# EAGLE design usb2cmi (EAGLE 4.11)

## Sheet 1 of 6
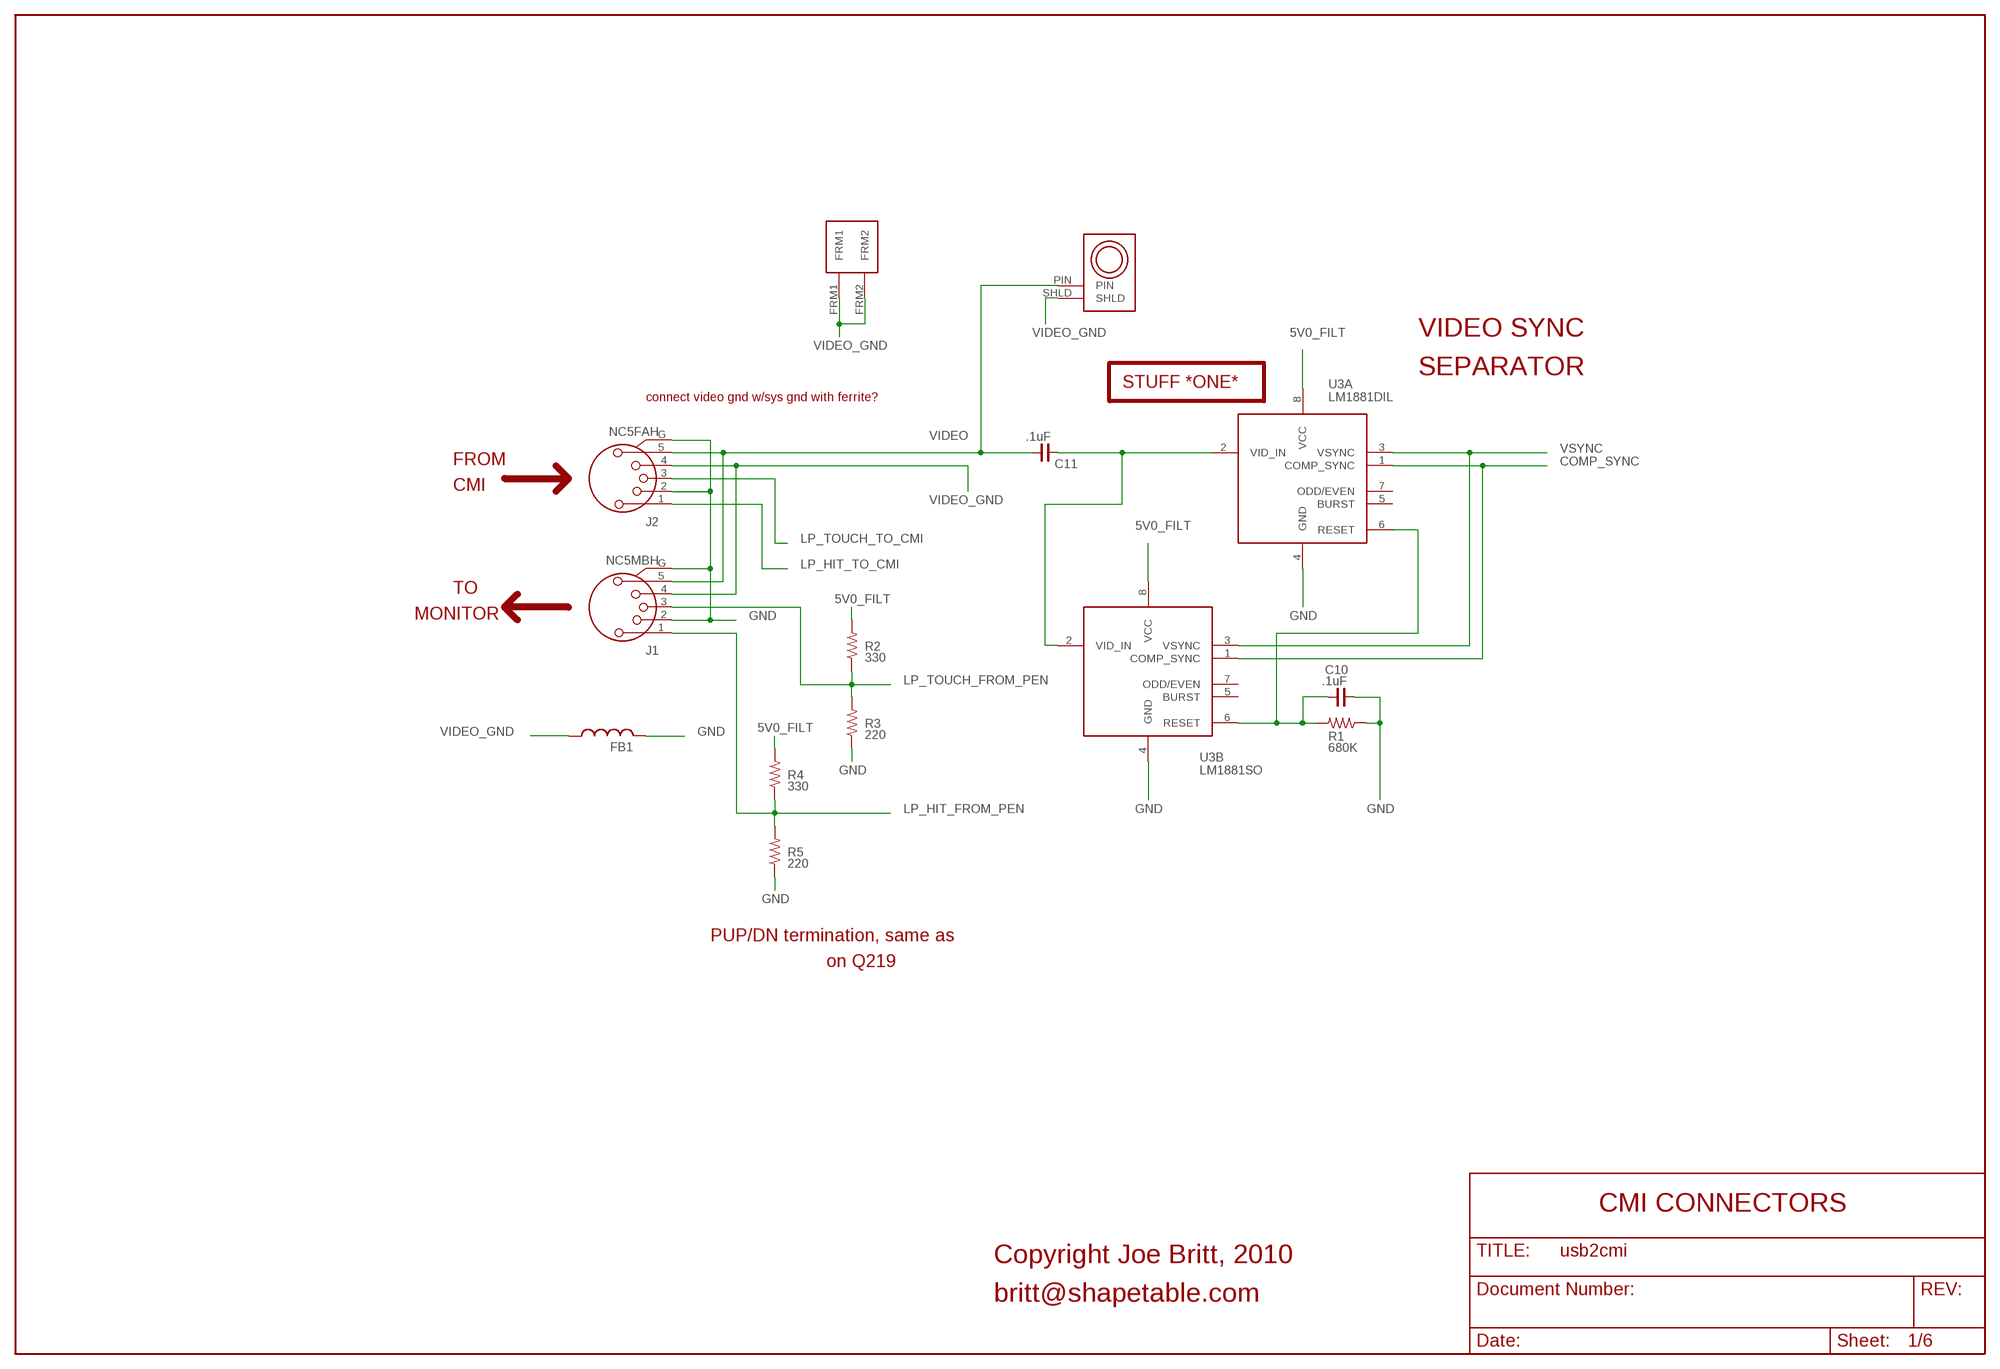
[diagram p0: schematic, sheet 1]

### Parts
C10  .1uF  C_0603  [C0603]
C11  .1uF  C_0603  [C0603]
FB1  L-US0207/15  [0207/15]
J1  NC5MBH  [NC5MBH]
J2  NC5FAH  [NC5FAH]
J3  RCA-HSC  [RCA-SHIELDED]
R1  680K  R_0603  [R0603]
R2  330  R_0603  [R0603]
R3  220  R_0603  [R0603]
R4  330  R_0603  [R0603]
R5  220  R_0603  [R0603]
U3A  LM1881DIL  [DIL08]
U3B  LM1881SO  [SO08]

### Nets
5V0_FILT: R2.2 R4.2 U3A.8(VCC) U3B.8(VCC) ; also sheet 2,3,5,6
COMP_SYNC: U3A.1(COMP_SYNC) U3B.1(COMP_SYNC) ; also sheet 2
GND: C10.2 FB1.2 J1.2 J1.G J2.2 J2.G R1.1 R3.1 R5.1 U3A.4(GND) U3B.4(GND) ; also sheet 2,3,5,6
LP_HIT_FROM_PEN: J1.1 R4.1 R5.2 ; also sheet 2
LP_HIT_TO_CMI: J2.1 ; also sheet 2
LP_TOUCH_FROM_PEN: J1.3 R2.1 R3.2 ; also sheet 2
LP_TOUCH_TO_CMI: J2.3 ; also sheet 2
N$4: C11.2 U3A.2(VID_IN) U3B.2(VID_IN)
N$6: C10.1 R1.2 U3A.6(RESET) U3B.6(RESET)
VIDEO: C11.1 J1.5 J2.5 J3.PIN
VIDEO_GND: FB1.1 J1.4 J2.4 J3.FRM1 J3.FRM2 J3.SHLD
VSYNC: U3A.3(VSYNC) U3B.3(VSYNC) ; also sheet 2
Unconnected: U3A.5(BURST) U3A.7(ODD/EVEN) U3B.5(BURST) U3B.7(ODD/EVEN)

### Notes on the sheet
- VIDEO SYNC
- SEPARATOR
- STUFF *ONE*
- connect video gnd w/sys gnd with ferrite?
- FROM
- CMI
- TO
- MONITOR
- PUP/DN termination, same as
- on Q219
- CMI CONNECTORS
- Copyright Joe Britt, 2010
- britt@shapetable.com

## Sheet 2 of 6
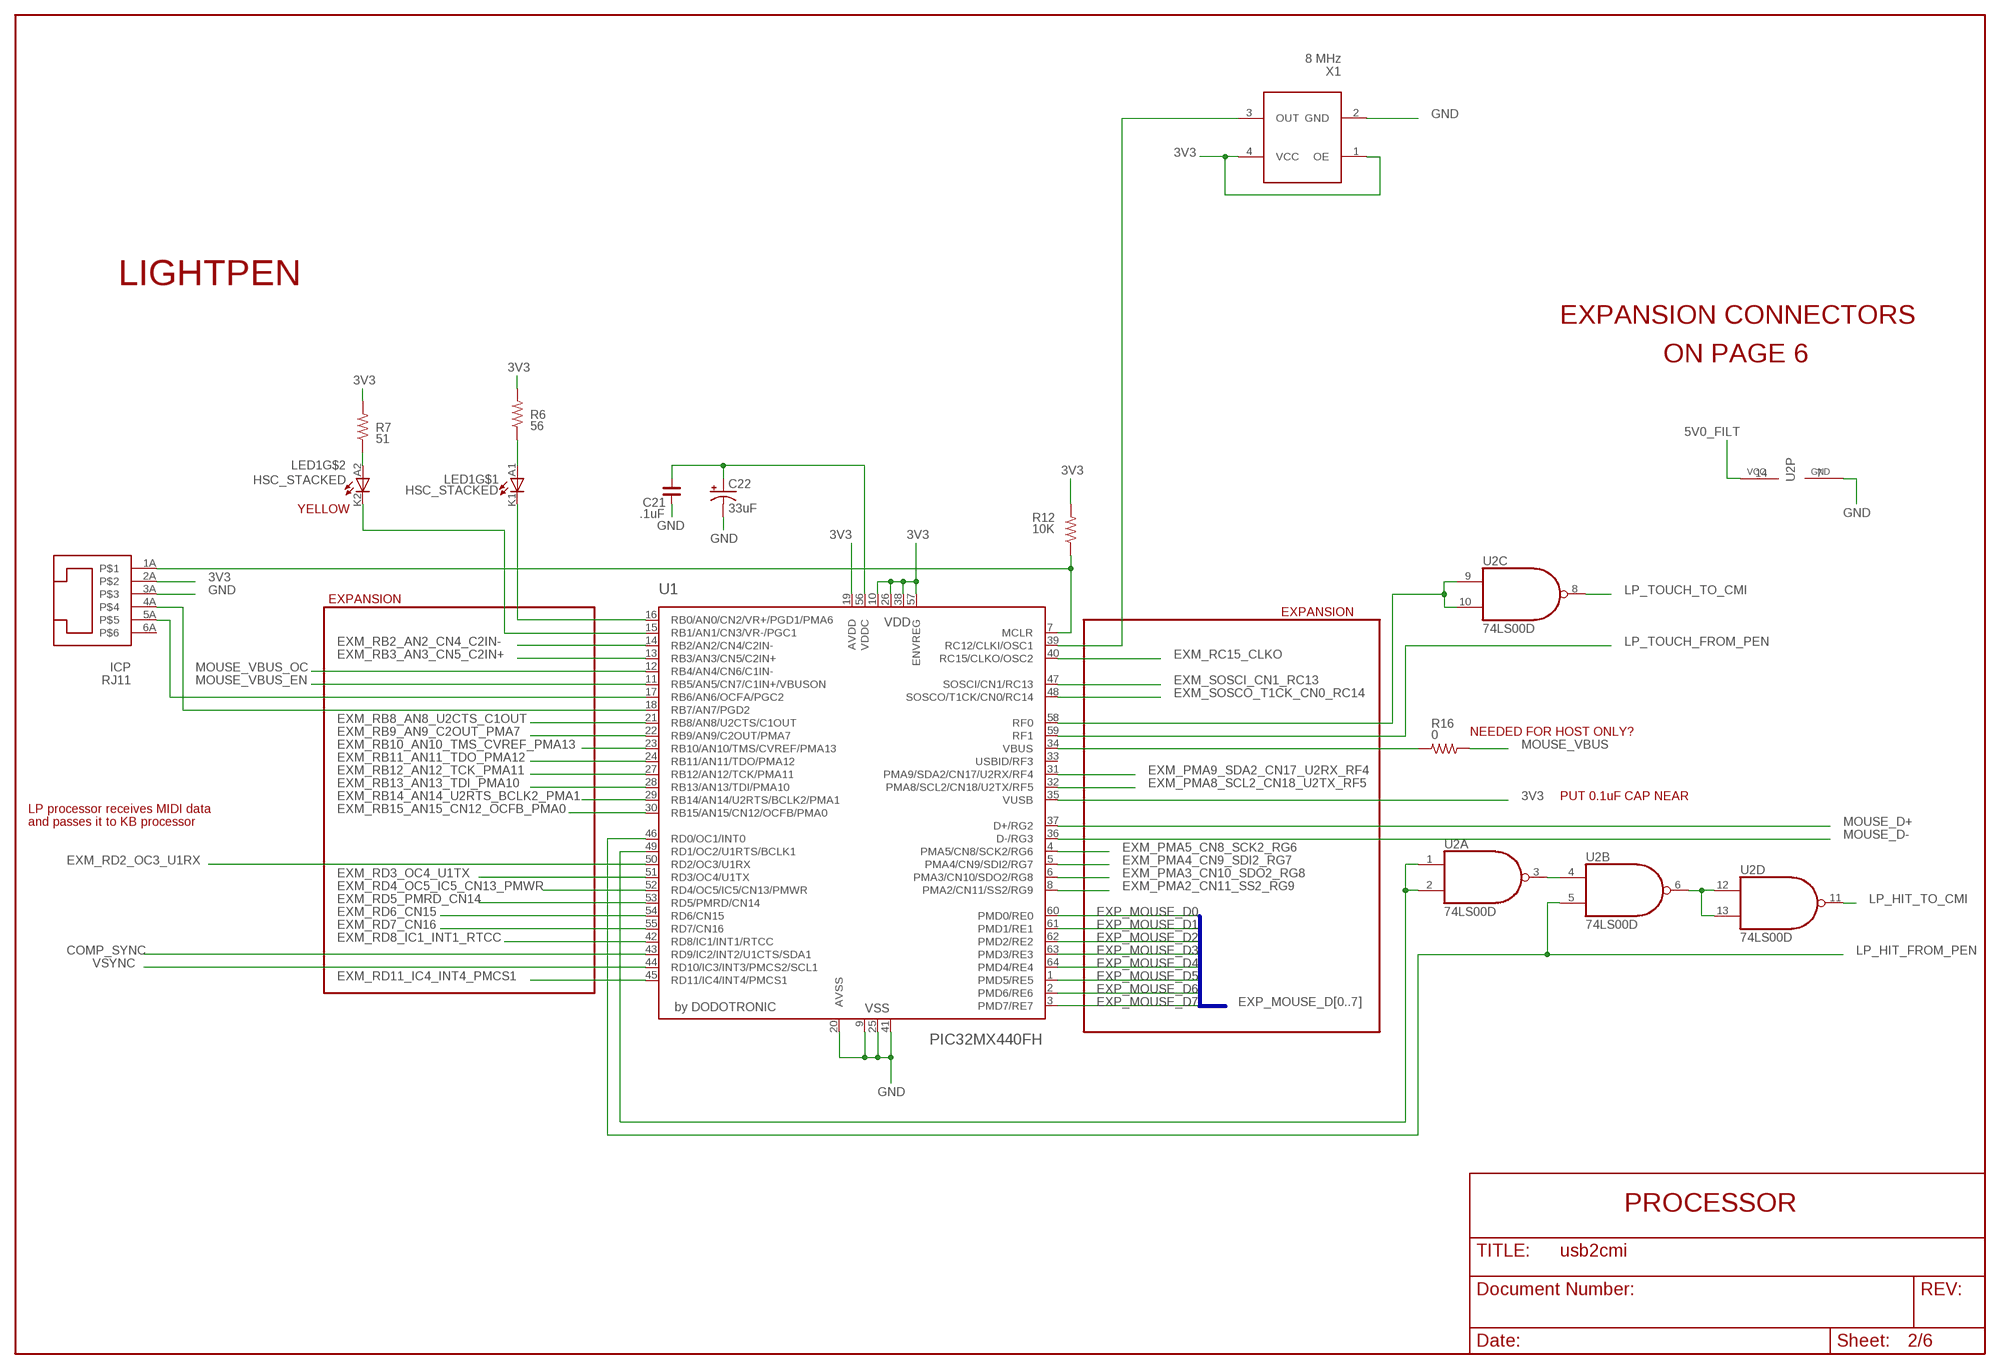
[diagram p1: schematic, sheet 2]

### Parts
C21  .1uF  C_0603  [C0603]
C22  33uF  CPOL-US085CS-1AR  [085CS_1AR]
ICP  RJ11  [RJ11]
LED1  HSC_STACKED  [HSC_STACKED]
R6  56  R_0603  [R0603]
R7  51  R_0603  [R0603]
R12  10K  R_0603  [R0603]
R16  0  R_0603  [R0603]
U1  PIC32MX440FH  [TQFP64-10X10]
U2  74LS00D  [SO14]
X1  8 MHz  CTS-OSC  [CTS-OSC]

### Nets
3V3: ICP.2A R6.2 R7.2 R12.2 U1.10(VDD) U1.19(AVDD) U1.26(VDD) U1.35(VUSB) U1.38(VDD) U1.57(ENVREG) X1.1(OE) X1.4(VCC) ; also sheet 3,6
5V0_FILT: U2.14(P:VCC) ; also sheet 1,3,5,6
COMP_SYNC: U1.43(RD9/IC2/INT2/U1CTS/SDA1) ; also sheet 1
EXM_PMA2_CN11_SS2_RG9: U1.8(PMA2/CN11/SS2/RG9) ; also sheet 6
EXM_PMA3_CN10_SDO2_RG8: U1.6(PMA3/CN10/SDO2/RG8) ; also sheet 6
EXM_PMA4_CN9_SDI2_RG7: U1.5(PMA4/CN9/SDI2/RG7) ; also sheet 6
EXM_PMA5_CN8_SCK2_RG6: U1.4(PMA5/CN8/SCK2/RG6) ; also sheet 6
EXM_PMA8_SCL2_CN18_U2TX_RF5: U1.32(PMA8/SCL2/CN18/U2TX/RF5) ; also sheet 6
EXM_PMA9_SDA2_CN17_U2RX_RF4: U1.31(PMA9/SDA2/CN17/U2RX/RF4) ; also sheet 6
EXM_RB0_AN0_CN2_PMA6: LED1.K1(K) U1.16(RB0/AN0/CN2/VR+/PGD1/PMA6)
EXM_RB2_AN2_CN4_C2IN-: U1.14(RB2/AN2/CN4/C2IN-)
EXM_RB3_AN3_CN5_C2IN+: U1.13(RB3/AN3/CN5/C2IN+)
EXM_RB8_AN8_U2CTS_C1OUT: U1.21(RB8/AN8/U2CTS/C1OUT)
EXM_RB9_AN9_C2OUT_PMA7: U1.22(RB9/AN9/C2OUT/PMA7)
EXM_RB10_AN10_TMS_CVREF_PMA13: U1.23(RB10/AN10/TMS/CVREF/PMA13) ; also sheet 6
EXM_RB11_AN11_TDO_PMA12: U1.24(RB11/AN11/TDO/PMA12) ; also sheet 6
EXM_RB12_AN12_TCK_PMA11: U1.27(RB12/AN12/TCK/PMA11) ; also sheet 6
EXM_RB13_AN13_TDI_PMA10: U1.28(RB13/AN13/TDI/PMA10) ; also sheet 6
EXM_RB14_AN14_U2RTS_BCLK2_PMA1: U1.29(RB14/AN14/U2RTS/BCLK2/PMA1) ; also sheet 6
EXM_RB15_AN15_CN12_OCFB_PMA0: U1.30(RB15/AN15/CN12/OCFB/PMA0) ; also sheet 6
EXM_RC15_CLKO: U1.40(RC15/CLKO/OSC2) ; also sheet 6
EXM_RD2_OC3_U1RX: U1.50(RD2/OC3/U1RX) ; also sheet 6
EXM_RD3_OC4_U1TX: U1.51(RD3/OC4/U1TX) ; also sheet 6
EXM_RD4_OC5_IC5_CN13_PMWR: U1.52(RD4/OC5/IC5/CN13/PMWR) ; also sheet 6
EXM_RD5_PMRD_CN14: U1.53(RD5/PMRD/CN14) ; also sheet 6
EXM_RD6_CN15: U1.54(RD6/CN15) ; also sheet 6
EXM_RD7_CN16: U1.55(RD7/CN16) ; also sheet 6
EXM_RD8_IC1_INT1_RTCC: U1.42(RD8/IC1/INT1/RTCC)
EXM_RD11_IC4_INT4_PMCS1: U1.45(RD11/IC4/INT4/PMCS1) ; also sheet 6
EXM_SOSCI_CN1_RC13: U1.47(SOSCI/CN1/RC13) ; also sheet 6
EXM_SOSCO_T1CK_CN0_RC14: U1.48(SOSCO/T1CK/CN0/RC14) ; also sheet 6
EXP_MOUSE_D0: U1.60(PMD0/RE0) ; also sheet 6
EXP_MOUSE_D1: U1.61(PMD1/RE1) ; also sheet 6
EXP_MOUSE_D2: U1.62(PMD2/RE2) ; also sheet 6
EXP_MOUSE_D3: U1.63(PMD3/RE3) ; also sheet 6
EXP_MOUSE_D4: U1.64(PMD4/RE4) ; also sheet 6
EXP_MOUSE_D5: U1.1(PMD5/RE5) ; also sheet 6
EXP_MOUSE_D6: U1.2(PMD6/RE6) ; also sheet 6
EXP_MOUSE_D7: U1.3(PMD7/RE7) ; also sheet 6
GND: C21.2 C22.- ICP.3A U1.9(VSS) U1.20(AVSS) U1.25(VSS) U1.41(VSS) U2.7(P:GND) X1.2(GND) ; also sheet 1,3,5,6
LP_HIT_FROM_PEN: U1.46(RD0/OC1/INT0) U2.5(B:I1) ; also sheet 1
LP_HIT_TO_CMI: U2.11(D:O) ; also sheet 1
LP_TOUCH_FROM_PEN: U1.59(RF1) ; also sheet 1
LP_TOUCH_TO_CMI: U2.8(C:O) ; also sheet 1
MOUSE_D+: U1.37(D+/RG2) ; also sheet 5
MOUSE_D-: U1.36(D-/RG3) ; also sheet 5
MOUSE_VBUS: R16.1 ; also sheet 5
MOUSE_VBUS_EN: U1.11(RB5/AN5/CN7/C1IN+/VBUSON) ; also sheet 5
MOUSE_VBUS_OC: U1.12(RB4/AN4/CN6/C1IN-) ; also sheet 5
N$1: C21.1 C22.+ U1.56(VDDC)
N$2: LED1.A1(A) R6.1
N$5: LED1.K2(K) U1.15(RB1/AN1/CN3/VR-/PGC1)
N$16: U1.39(RC12/CLKI/OSC1) X1.3(OUT)
N$25: ICP.4A U1.18(RB7/AN7/PGD2)
N$26: ICP.5A U1.17(RB6/AN6/OCFA/PGC2)
N$27: U1.58(RF0) U2.9(C:I0) U2.10(C:I1)
N$29: U2.6(B:O) U2.12(D:I0) U2.13(D:I1)
N$30: U2.3(A:O) U2.4(B:I0)
N$31: U1.49(RD1/OC2/U1RTS/BCLK1) U2.1(A:I0) U2.2(A:I1)
N$34: LED1.A2(A) R7.1
N$36: R16.2 U1.34(VBUS)
U2_MCLR: ICP.1A R12.1 U1.7(MCLR)
VSYNC: U1.44(RD10/IC3/INT3/PMCS2/SCL1) ; also sheet 1
Unconnected: ICP.6A U1.33(USBID/RF3)

### Buses
EXP_MOUSE_D[0..7]

### Notes on the sheet
- LIGHTPEN
- EXPANSION CONNECTORS
- ON PAGE 6
- YELLOW
- EXPANSION
- EXPANSION
- NEEDED FOR HOST ONLY?
- PUT 0.1uF CAP NEAR
- LP processor receives MIDI data
- and passes it to KB processor
- PROCESSOR

## Sheet 3 of 6
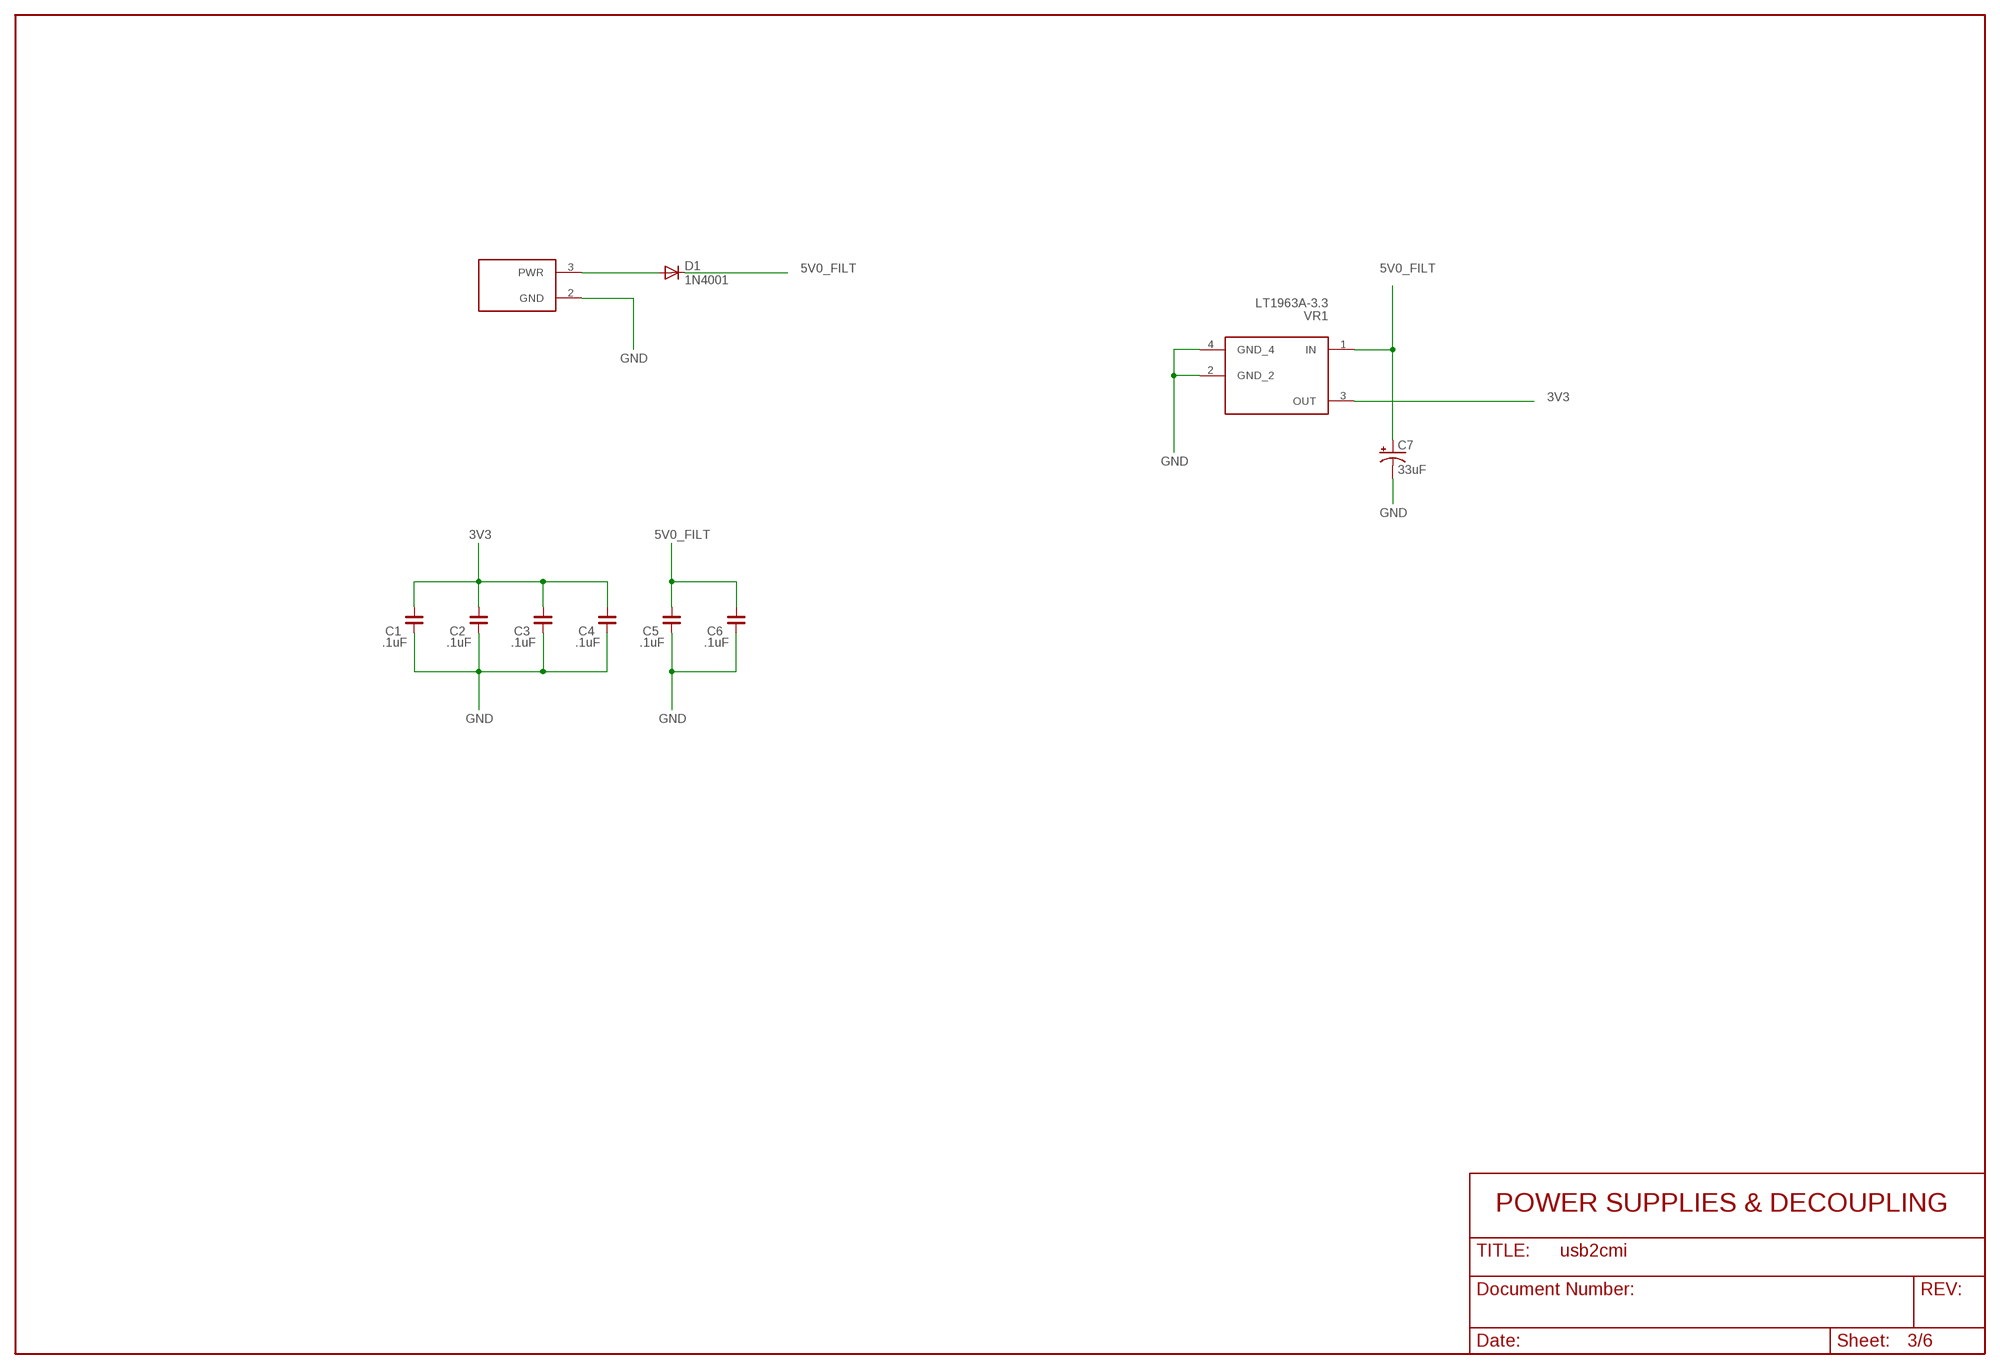
[diagram p2: schematic, sheet 3]

### Parts
C1  .1uF  C_0603  [C0603]
C2  .1uF  C_0603  [C0603]
C3  .1uF  C_0603  [C0603]
C4  .1uF  C_0603  [C0603]
C5  .1uF  C_0603  [C0603]
C6  .1uF  C_0603  [C0603]
C7  33uF  CPOL-US085CS-1AR  [085CS_1AR]
D1  1N4001  1N4004  [DO41-10]
J4  DANGER_POWER  [DANGER-POWER]
VR1  LT1963A-3.3  LINEAR-REG-SOT223  [SOT-223]

### Nets
3V3: C1.1 C2.1 C3.1 C4.1 VR1.3(OUT) ; also sheet 2,6
5V0_FILT: C5.1 C6.1 C7.+ D1.C VR1.1(IN) ; also sheet 1,2,5,6
GND: C1.2 C2.2 C3.2 C4.2 C5.2 C6.2 C7.- J4.2(GND) VR1.2(GND_2) VR1.4(GND_4) ; also sheet 1,2,5,6
N$3: D1.A J4.3(PWR)

### Notes on the sheet
- POWER SUPPLIES & DECOUPLING

## Sheet 4 of 6
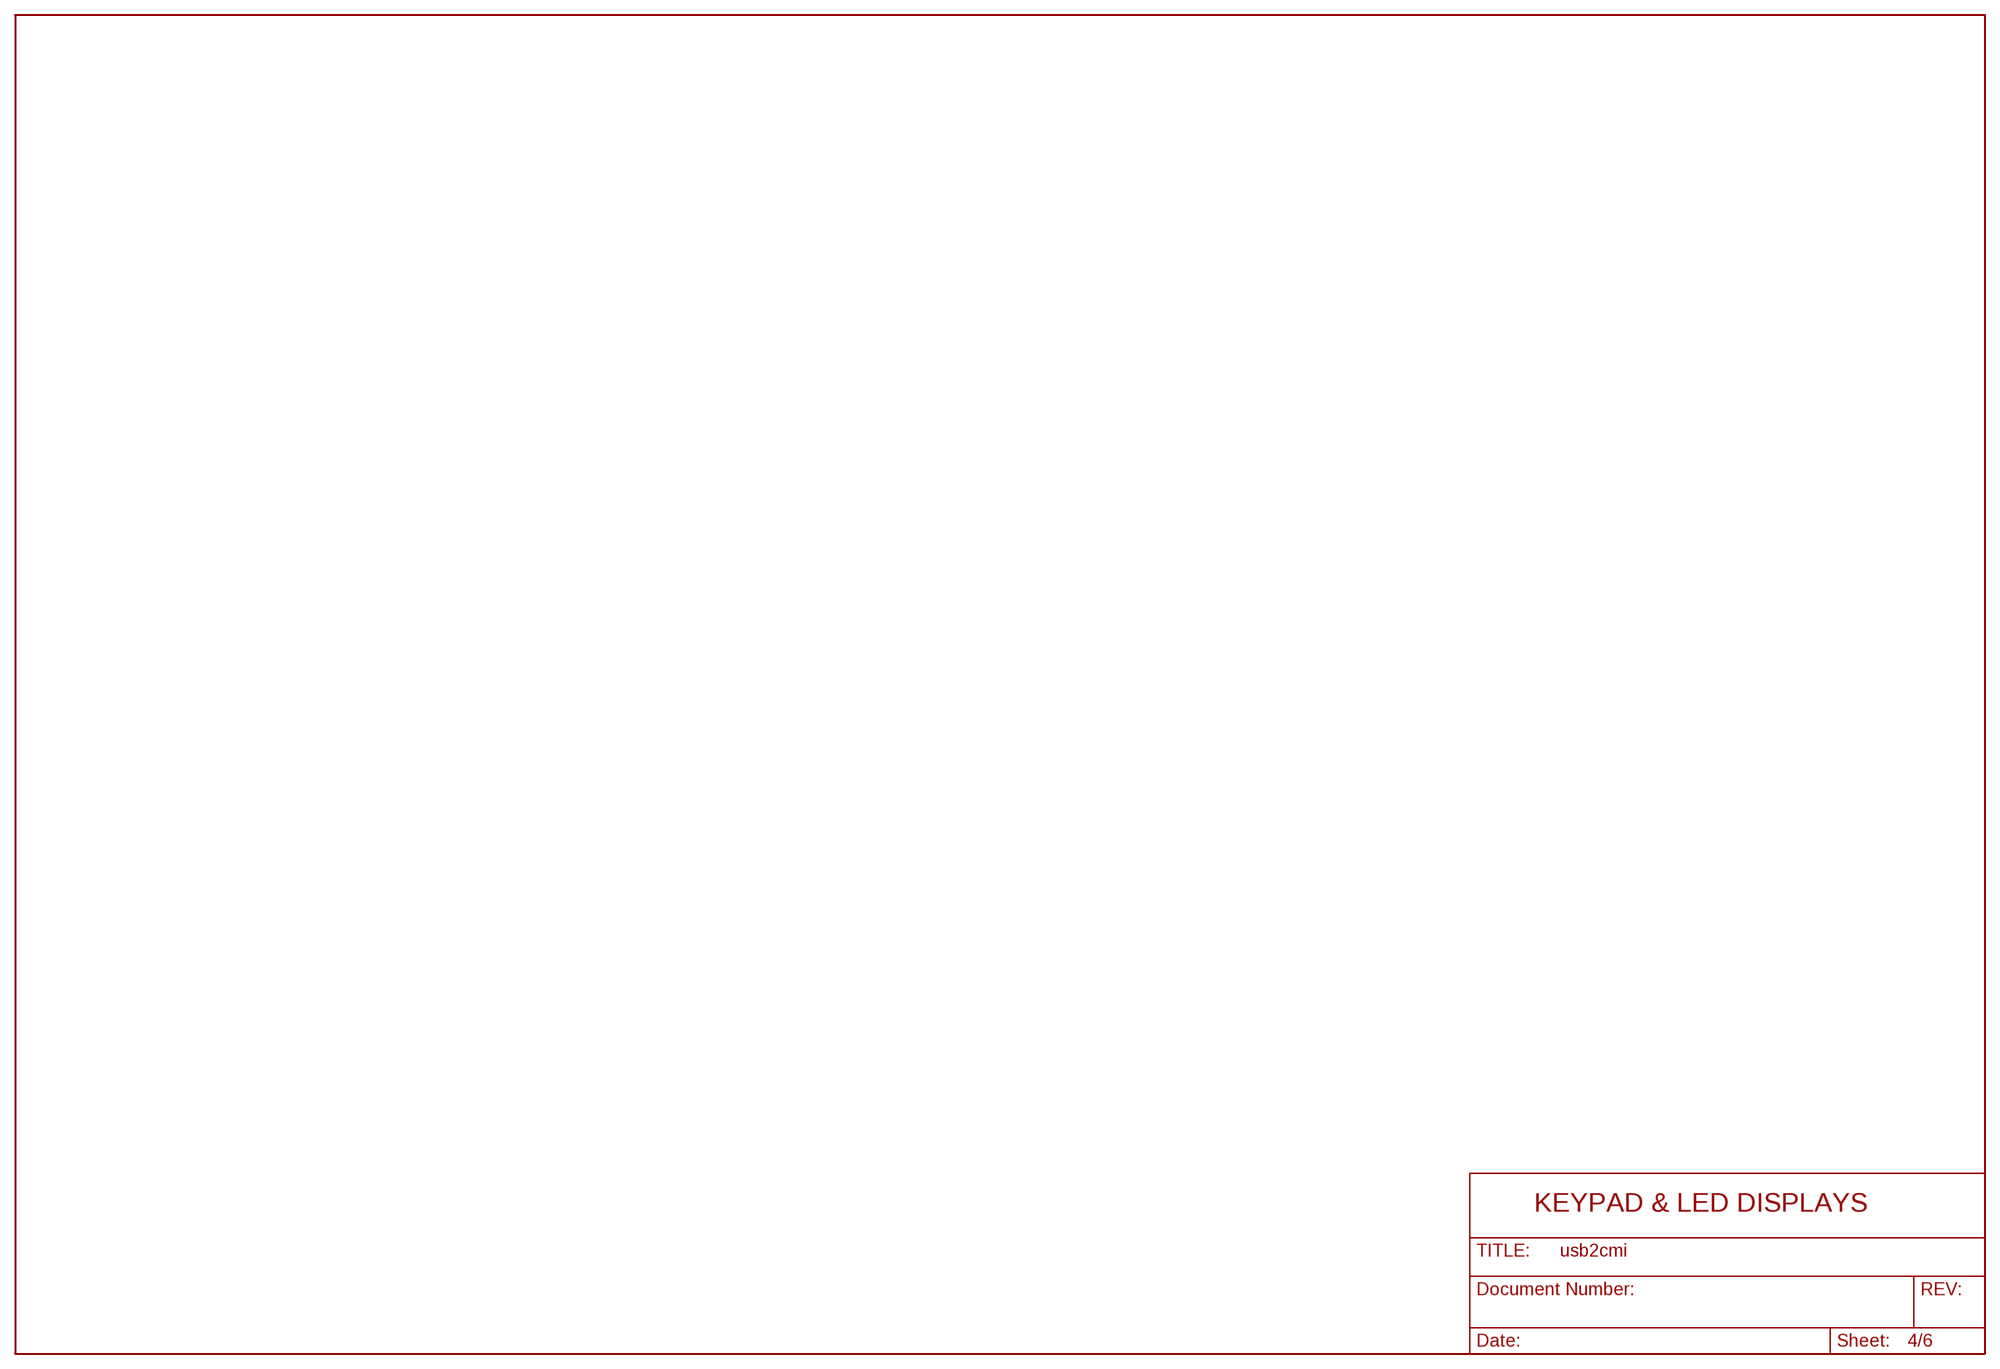
[diagram p3: schematic, sheet 4]

### Notes on the sheet
- KEYPAD & LED DISPLAYS

## Sheet 5 of 6
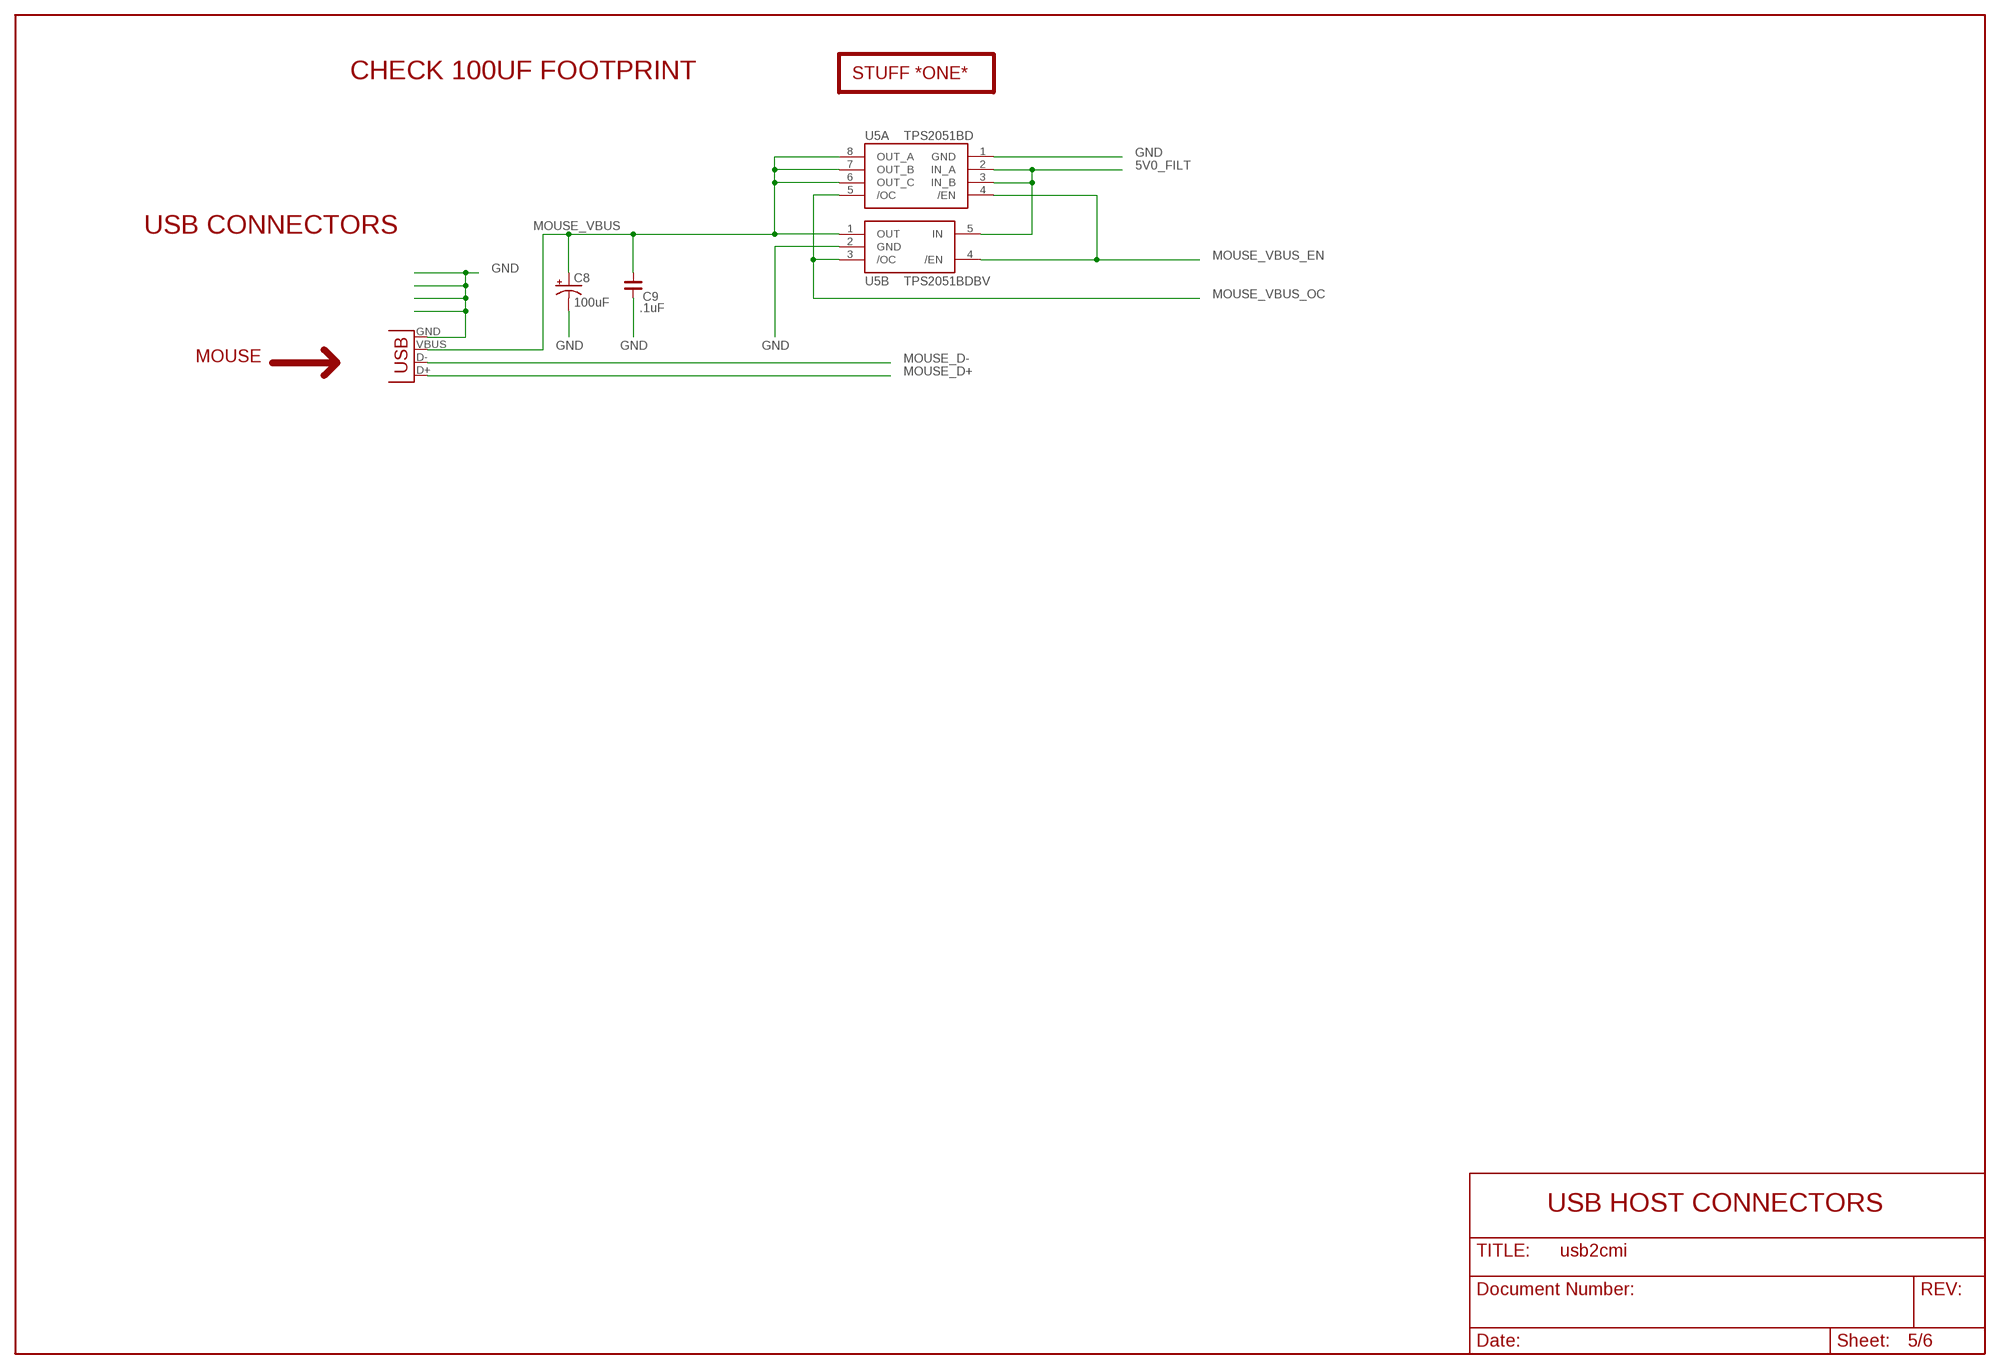
[diagram p4: schematic, sheet 5]

### Parts
C8  100uF  CPOL-USCT6032  [CT6032]
C9  .1uF  C_0603  [C0603]
J5  USB-A-H  [USB-A-H]
U5A  TPS2051BD  TPS2041BD  [SO-08]
U5B  TPS2051BDBV  TPS2041BDBV  [DBV-5]

### Nets
5V0_FILT: U5A.2(IN_A) U5A.3(IN_B) U5B.5(IN) ; also sheet 1,2,3,6
GND: C8.- C9.2 J5.GND U5A.1(GND) U5B.2(GND) ; also sheet 1,2,3,6
MOUSE_D+: J5.D+ ; also sheet 2
MOUSE_D-: J5.D- ; also sheet 2
MOUSE_VBUS: C8.+ C9.1 J5.VBUS U5A.6(OUT_C) U5A.7(OUT_B) U5A.8(OUT_A) U5B.1(OUT) ; also sheet 2
MOUSE_VBUS_EN: U5A.4(/EN) U5B.4(/EN) ; also sheet 2
MOUSE_VBUS_OC: U5A.5(/OC) U5B.3(/OC) ; also sheet 2

### Notes on the sheet
- CHECK 100UF FOOTPRINT | STUFF *ONE*
- USB CONNECTORS
- MOUSE
- USB HOST CONNECTORS

## Sheet 6 of 6
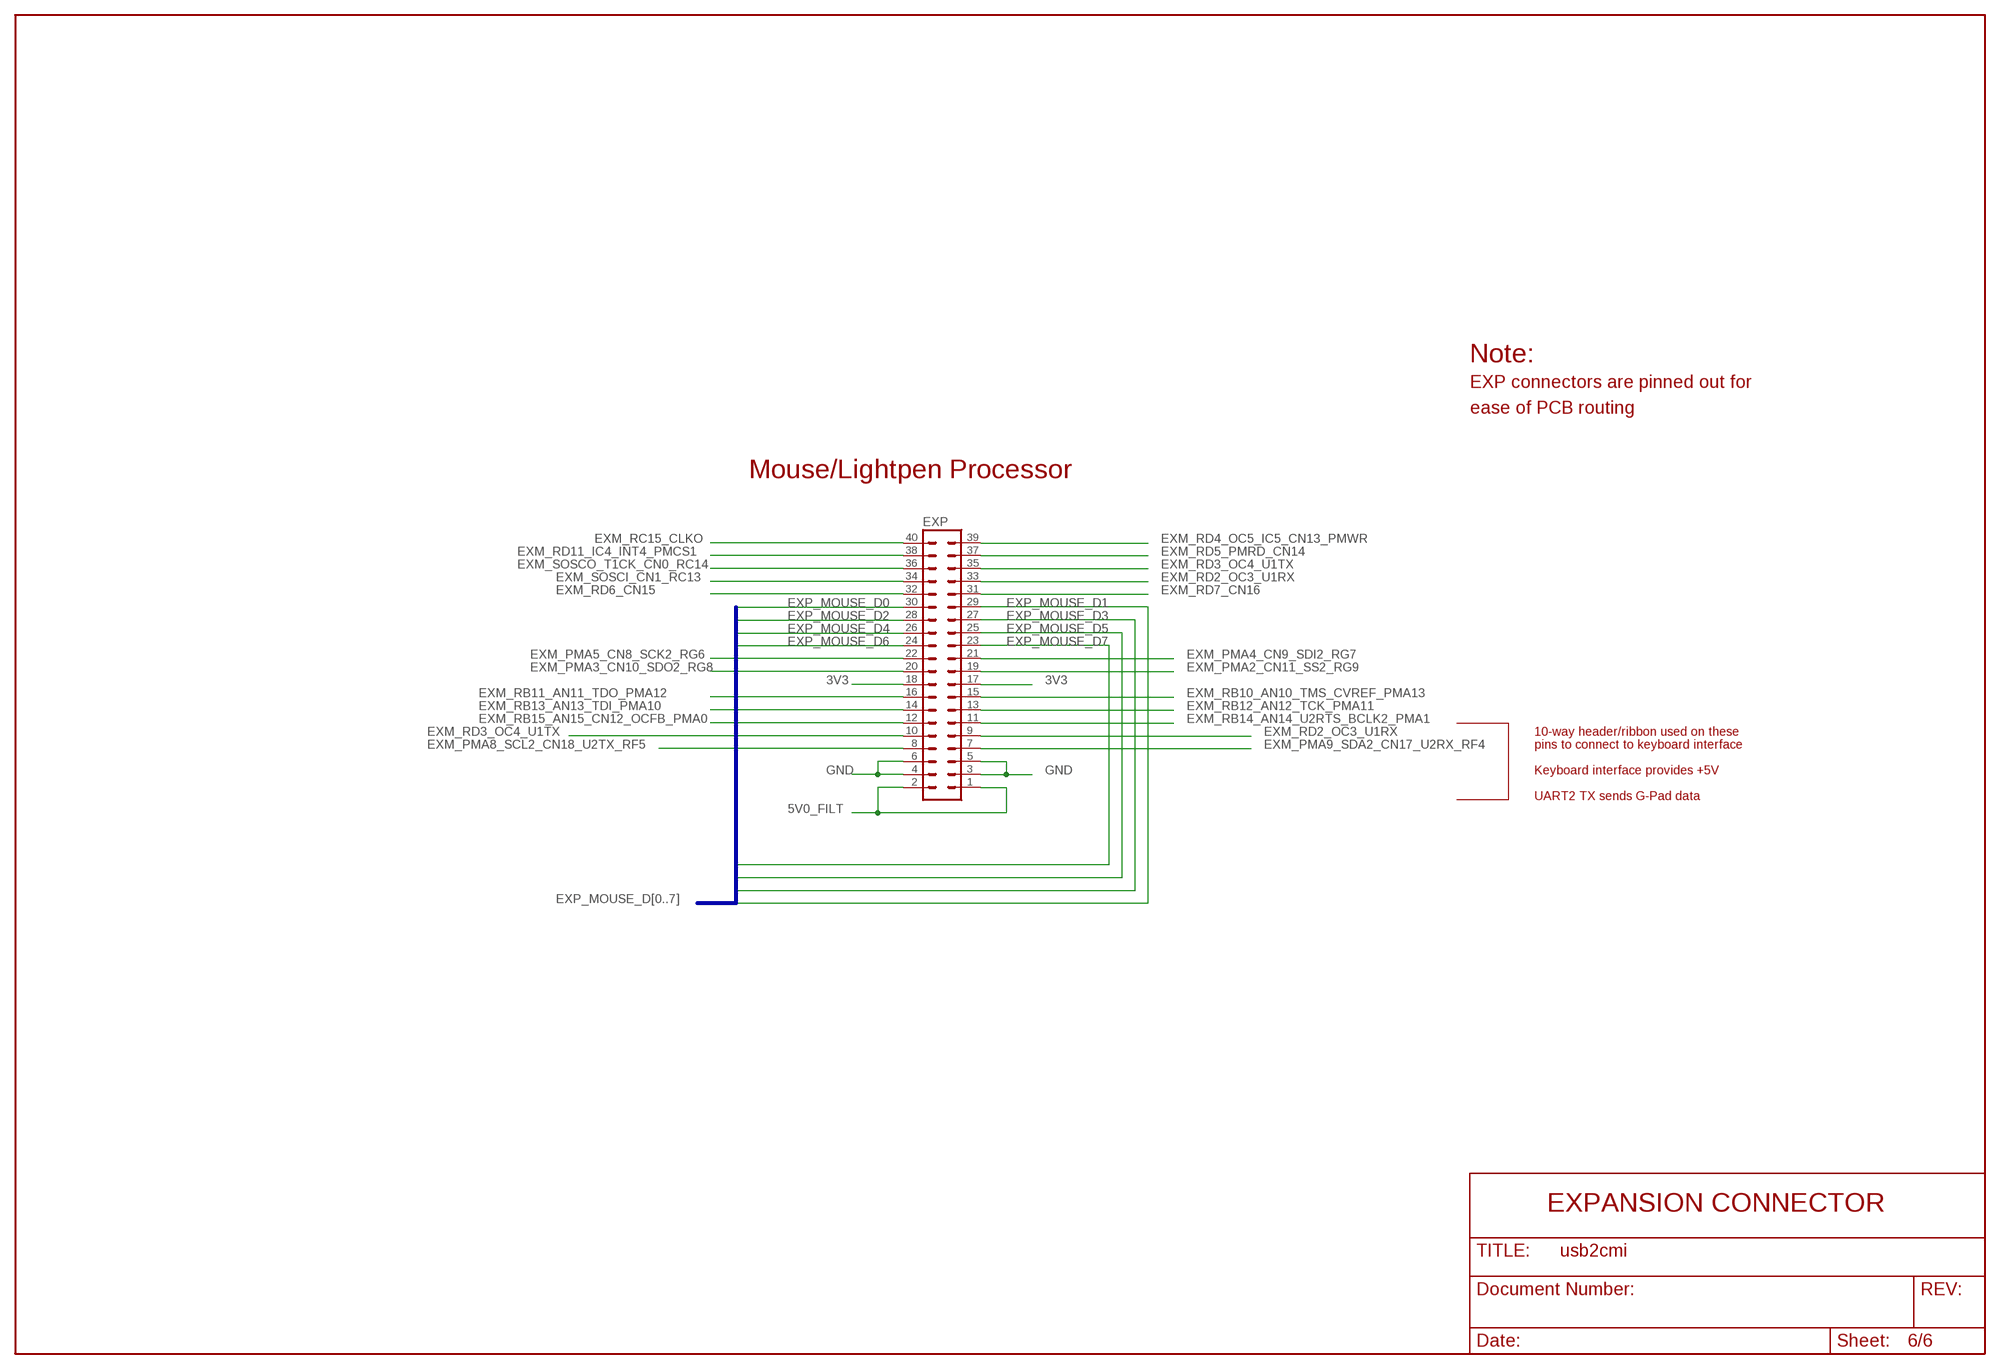
[diagram p5: schematic, sheet 6]

### Parts
EXP  MA20-2  [MA20-2]

### Nets
3V3: EXP.17 EXP.18 ; also sheet 2,3
5V0_FILT: EXP.1 EXP.2 ; also sheet 1,2,3,5
EXM_PMA2_CN11_SS2_RG9: EXP.19 ; also sheet 2
EXM_PMA3_CN10_SDO2_RG8: EXP.20 ; also sheet 2
EXM_PMA4_CN9_SDI2_RG7: EXP.21 ; also sheet 2
EXM_PMA5_CN8_SCK2_RG6: EXP.22 ; also sheet 2
EXM_PMA8_SCL2_CN18_U2TX_RF5: EXP.8 ; also sheet 2
EXM_PMA9_SDA2_CN17_U2RX_RF4: EXP.7 ; also sheet 2
EXM_RB10_AN10_TMS_CVREF_PMA13: EXP.15 ; also sheet 2
EXM_RB11_AN11_TDO_PMA12: EXP.16 ; also sheet 2
EXM_RB12_AN12_TCK_PMA11: EXP.13 ; also sheet 2
EXM_RB13_AN13_TDI_PMA10: EXP.14 ; also sheet 2
EXM_RB14_AN14_U2RTS_BCLK2_PMA1: EXP.11 ; also sheet 2
EXM_RB15_AN15_CN12_OCFB_PMA0: EXP.12 ; also sheet 2
EXM_RC15_CLKO: EXP.40 ; also sheet 2
EXM_RD2_OC3_U1RX: EXP.9 EXP.33 ; also sheet 2
EXM_RD3_OC4_U1TX: EXP.10 EXP.35 ; also sheet 2
EXM_RD4_OC5_IC5_CN13_PMWR: EXP.39 ; also sheet 2
EXM_RD5_PMRD_CN14: EXP.37 ; also sheet 2
EXM_RD6_CN15: EXP.32 ; also sheet 2
EXM_RD7_CN16: EXP.31 ; also sheet 2
EXM_RD11_IC4_INT4_PMCS1: EXP.38 ; also sheet 2
EXM_SOSCI_CN1_RC13: EXP.34 ; also sheet 2
EXM_SOSCO_T1CK_CN0_RC14: EXP.36 ; also sheet 2
EXP_MOUSE_D0: EXP.30 ; also sheet 2
EXP_MOUSE_D1: EXP.29 ; also sheet 2
EXP_MOUSE_D2: EXP.28 ; also sheet 2
EXP_MOUSE_D3: EXP.27 ; also sheet 2
EXP_MOUSE_D4: EXP.26 ; also sheet 2
EXP_MOUSE_D5: EXP.25 ; also sheet 2
EXP_MOUSE_D6: EXP.24 ; also sheet 2
EXP_MOUSE_D7: EXP.23 ; also sheet 2
GND: EXP.3 EXP.4 EXP.5 EXP.6 ; also sheet 1,2,3,5

### Buses
EXP_MOUSE_D[0..7]

### Notes on the sheet
- Note:
- EXP connectors are pinned out for
- ease of PCB routing
- Mouse/Lightpen Processor
- 10-way header/ribbon used on these
- pins to connect to keyboard interface
- Keyboard interface provides +5V
- UART2 TX sends G-Pad data
- EXPANSION CONNECTOR

## Library data of the parts
C1-C6 C9-C11 C21 = rc-master-smd:C_: NON-POLARIZED CAP
C7 C22 = rcl_joe:CPOL-US: POLARIZED CAPACITOR, American symbol
C8 = rcl:CPOL-US: POLARIZED CAPACITOR, American symbol
D1 = diode:1N4004: DIODE general purpose rectifier, 1 A
EXP = con-lstb:MA20-2: PIN HEADER
FB1 = rcl:L-US: INDUCTOR, American symbol
ICP = rj11:RJ11
J1 J2 = con-neutrik_ag:NC5: Neutrik Audio Connector XLR SERIES Stereo 1/4" jack Source: www.neutrik.com/
J3 = con-rca-hsc:RCA-HSC
J4 = danger_power:DANGER_POWER
J5 = con-usb (1):USB: USB Connectors
LED1 = led_hsc:HSC_STACKED
R1-R7 R12 R16 = rc-master-smd:R_: RESISTOR
U1 = DodoMicroR3:PIC32MX440F*H: Microchip PIC32 USB
U2 = 74xx-us:74*00: Quad 2-input NAND gate
U3A U3B = ns-linear:LM1881
U5A = TPS2041:TPS2041BD
U5B = TPS2041:TPS2041BDBV
VR1 = power:LINEAR-REG-SOT223
X1 = Nintendo:CTS-OSC

## Board
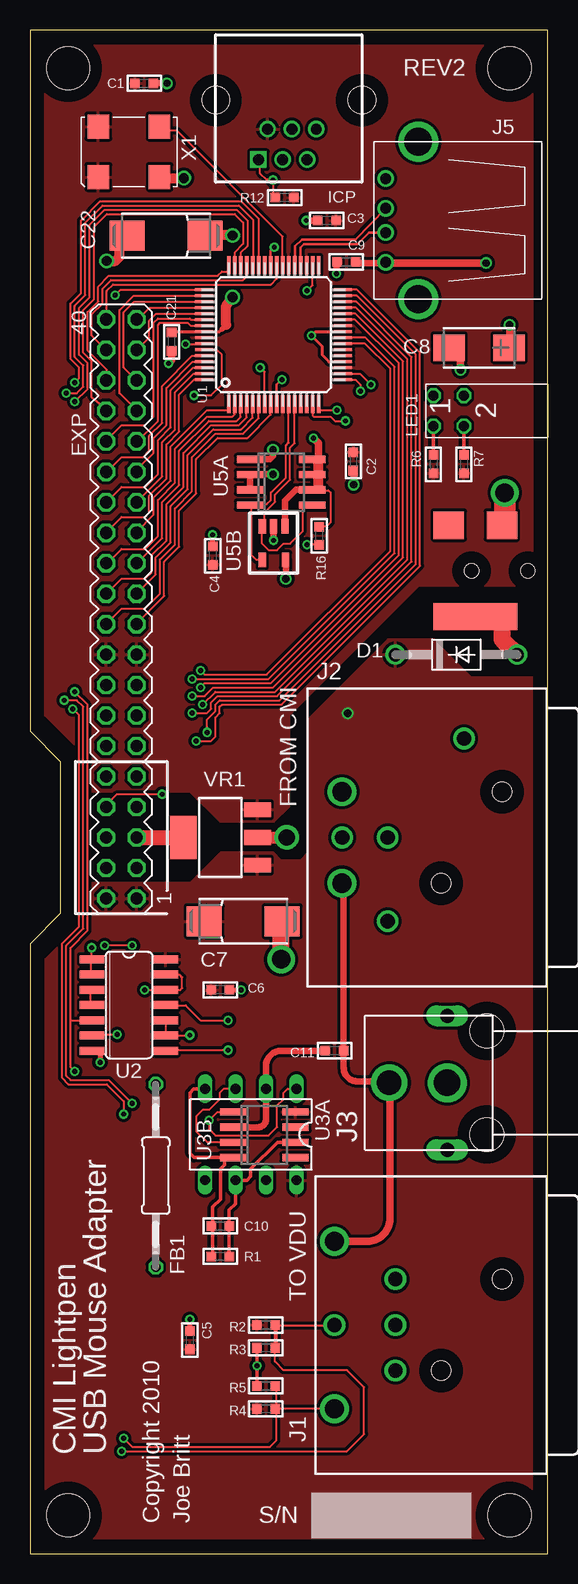
[diagram p6: board, top side]
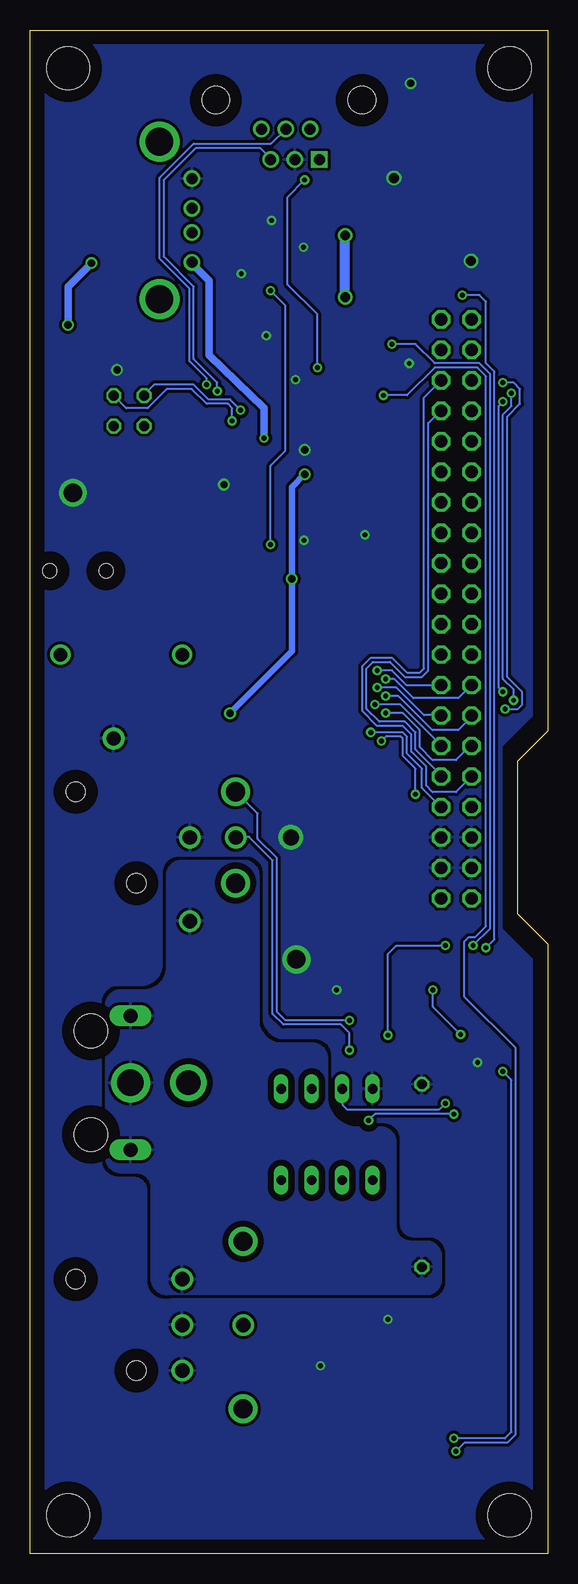
[diagram p7: board, bottom side, seen from below]

Size 43.18 x 127 mm. Coordinates in mm from the lower left corner, seen from the top.
Outline: 0,0 43.18,0 43.18,127 0,127 0,68.58 2.54,66.04 2.54,53.34 0,50.8 0,0
Copper layers (1*16): Top 0.035mm / dielectric 1.5mm / Bottom 0.035mm
Design rules "default": minimum track width 7mil, minimum drill 16mil, track to track 7mil, track to pad 7mil, pad to pad 7mil, via to via 7mil, smd to smd 7mil, copper to edge 40mil, drill to drill 7mil, minimum pad ring 7mil, minimum via ring 7mil, stop-mask expansion 4mil, vias tented up to drill 0mil, thermal gap 10mil
Holes 3.58 mm at 40.01,123.83 40.01,3.17 3.17,3.17 3.17,123.83

### Footprints (pad centres in the part's own frame; a part is rotated, then mirrored left to right if it is on the bottom)
C0603 = smd 0.8 x 0.8: 1 -0.762,0; 2 0.762,0
085CS_1AR = smd 2.9 x 2.5: + 3.25,0; - -3.25,0
CT6032 = smd 2.6 x 2.2: + 2.5,0; - -2.5,0
DO41-10 = drill 1.118 round: A 5.08,0; C -5.08,0
MA20-2 = drill 1.016 octagon: 1 -24.13,-1.27; 2 -24.13,1.27; 3 -21.59,-1.27; 4 -21.59,1.27; 5 -19.05,-1.27; 6 -19.05,1.27; 7 -16.51,-1.27; 8 -16.51,1.27; 9 -13.97,-1.27; 10 -13.97,1.27; 11 -11.43,-1.27; 12 -11.43,1.27; 13 -8.89,-1.27; 14 -8.89,1.27; 15 -6.35,-1.27; 16 -6.35,1.27; 17 -3.81,-1.27; 18 -3.81,1.27; 19 -1.27,-1.27; 20 -1.27,1.27; 21 1.27,-1.27; 22 1.27,1.27; 23 3.81,-1.27; 24 3.81,1.27; 25 6.35,-1.27; 26 6.35,1.27; 27 8.89,-1.27; 28 8.89,1.27; 29 11.43,-1.27; 30 11.43,1.27; 31 13.97,-1.27; 32 13.97,1.27; 33 16.51,-1.27; 34 16.51,1.27; 35 19.05,-1.27; 36 19.05,1.27; 37 21.59,-1.27; 38 21.59,1.27; 39 24.13,-1.27; 40 24.13,1.27
0207/15 = drill 0.813 octagon: 1 -7.62,0; 2 7.62,0
RJ11 = drill 0.914 square: 1A -2.54,0 | drill 0.914 round: 2A -1.778,2.54; 3A -0.508,0; 4A 0.254,2.54; 5A 1.524,0; 6A 2.286,2.54 | hole 2.286: -6.096,4.953; 6.096,4.953
NC5MBH = drill 1.6 round: 1 6.98,-5.08; 5 -6.98,-5.08 | drill 1.2 round: 2 3.81,0; 3 0,-5.08; 4 -3.81,0; G 0,0 | hole 1.6: 3.81,3.81; -3.81,8.89
NC5FAH = drill 1.6 round: 1 -3.81,-3.815; 5 3.81,-3.815 | drill 1.2 round: 2 0,0; 3 0,-3.815; 4 6.98,0; G -8.25,6.355 | hole 1.6: 3.81,4.445; -3.81,9.525
RCA-SHIELDED = drill 1.168 long: FRM1 6.858,11.176; FRM2 6.858,0 | drill 2.032 round: PIN 2.032,5.588 | drill 2.235 round: SHLD 6.858,5.588 | hole 2.794: 10.16,9.906; 10.16,1.27
DANGER-POWER = smd 2.54 x 2.286: 1 -2.54,3.81; 2 1.905,3.81 | smd 6.985 x 2.286: 3 -0.318,-3.81 | hole 1.168: -0.635,0; 4.064,0
USB-A-H = drill 0.914 round: D+ 2.718,-1.003; D- 2.718,1.003; GND 2.718,-3.493; VBUS 2.718,3.493 | drill 2.311 round: P$5 0,-6.566; P$6 0,6.566
HSC_STACKED = drill 0.813 octagon: A1 -1.27,-0.635; A2 -1.27,-3.175; K1 1.27,-0.635; K2 1.27,-3.175
R0603 = smd 0.8 x 0.8: 1 -0.762,0; 2 0.762,0
TQFP64-10X10 = smd 1.5 x 0.28: 1 -5.8,3.75; 2 -5.8,3.25; 3 -5.8,2.75; 4 -5.8,2.25; 5 -5.8,1.75; 6 -5.8,1.25; 7 -5.8,0.75; 8 -5.8,0.25; 9 -5.8,-0.25; 10 -5.8,-0.75; 11 -5.8,-1.25; 12 -5.8,-1.75; 13 -5.8,-2.25; 14 -5.8,-2.75; 15 -5.8,-3.25; 16 -5.8,-3.75; 33 5.8,-3.75; 34 5.8,-3.25; 35 5.8,-2.75; 36 5.8,-2.25; 37 5.8,-1.75; 38 5.8,-1.25; 39 5.8,-0.75; 40 5.8,-0.25; 41 5.8,0.25; 42 5.8,0.75; 43 5.8,1.25; 44 5.8,1.75; 45 5.8,2.25; 46 5.8,2.75; 47 5.8,3.25; 48 5.8,3.75 | smd 0.28 x 1.5: 17 -3.75,-5.8; 18 -3.25,-5.8; 19 -2.75,-5.8; 20 -2.25,-5.8; 21 -1.75,-5.8; 22 -1.25,-5.8; 23 -0.75,-5.8; 24 -0.25,-5.8; 25 0.25,-5.8; 26 0.75,-5.8; 27 1.25,-5.8; 28 1.75,-5.8; 29 2.25,-5.8; 30 2.75,-5.8; 31 3.25,-5.8; 32 3.75,-5.8; 49 3.75,5.8; 50 3.25,5.8; 51 2.75,5.8; 52 2.25,5.8; 53 1.75,5.8; 54 1.25,5.8; 55 0.75,5.8; 56 0.25,5.8; 57 -0.25,5.8; 58 -0.75,5.8; 59 -1.25,5.8; 60 -1.75,5.8; 61 -2.25,5.8; 62 -2.75,5.8; 63 -3.25,5.8; 64 -3.75,5.8
SO14 = smd 0.66 x 2.032: 1 -3.81,-3.073; 2 -2.54,-3.073; 3 -1.27,-3.073; 4 0,-3.073; 5 1.27,-3.073; 6 2.54,-3.073; 7 3.81,-3.073; 8 3.81,3.073; 9 2.54,3.073; 10 1.27,3.073; 11 0,3.073; 12 -1.27,3.073; 13 -2.54,3.073; 14 -3.81,3.073
DIL08 = drill 0.813 long: 1 -3.81,-3.81; 2 -1.27,-3.81; 3 1.27,-3.81; 4 3.81,-3.81; 5 3.81,3.81; 6 1.27,3.81; 7 -1.27,3.81; 8 -3.81,3.81
SO08 = smd 0.6 x 2.2: 1 -1.905,-2.6; 2 -0.635,-2.6; 3 0.635,-2.6; 4 1.905,-2.6; 5 1.905,2.6; 6 0.635,2.6; 7 -0.635,2.6; 8 -1.905,2.6
SO-08 = smd 0.6 x 2.2: 1 -1.905,-2.6; 2 -0.635,-2.6; 3 0.635,-2.6; 4 1.905,-2.6; 5 1.905,2.6; 6 0.635,2.6; 7 -0.635,2.6; 8 -1.905,2.6
DBV-5 = smd 1.2 x 0.6: 1 -1.4,0.95; 2 -1.4,0; 3 -1.4,-0.95; 4 1.4,-0.95; 5 1.4,1
SOT-223 = smd 1.219 x 2.235: 1 -2.311,-3.099; 2 0,-3.099; 3 2.311,-3.099 | smd 3.6 x 2.2: 4 0,3.099
CTS-OSC = smd 1.8 x 2: 1 -2.55,-2.1; 2 2.55,-2.1; 3 2.55,2.1; 4 -2.55,2.1

### Placement (x,y rotation side)
C1  9.53,122.56 0 top
C2  26.97,91.03 270 top
C3  24.77,111.12 180 top
C4  15.24,83.19 90 top
C5  13.34,17.78 90 top
C6  15.88,46.99 0 top
C7  17.78,52.7 180 top
C8  37.47,100.51 0 top
C9  26.39,107.67 180 top
C10  15.88,27.3 180 top
C11  25.4,41.91 180 top
C21  11.81,101.02 270 top
C22  11.35,109.86 0 top
D1  35.56,74.93 0 top
EXP  7.62,78.74 90 top
FB1  10.49,31.5 90 top
ICP  21.59,116.2 0 top
J1  30.48,19.05 270 top
J2  29.84,59.69 270 top
J3  27.94,33.66 0 top
J4  37.47,81.92 0 top
J5  32.38,111.12 180 top
LED1  33.02,95.25 90 top
R1  15.88,24.77 0 top
R2  19.68,19.05 180 top
R3  19.68,17.14 0 top
R4  19.68,12.06 180 top
R5  19.68,13.97 0 top
R6  33.66,90.81 270 top
R7  36.2,90.81 270 top
R12  21.23,113.03 0 top
R16  24.13,84.84 270 top
U1  20.32,101.6 90 top
U2  8.26,45.72 270 top
U3A  18.41,34.92 180 top
U3B  19.55,34.9 270 top
U5A  20.95,89.31 270 top
U5B  20.32,84.23 270 top
VR1  15.88,59.69 90 top
X1  8.26,116.84 0 top

### Tracks (layer width: path | path; a pad name or v marks a point on that pad's centre or on a via)
3V3
  pour Top (isolate 0.254): 41.91,125.73 41.91,80.64 32.38,80.64 21.59,69.85 21.59,62.23 20.32,60.96 15.88,60.96 13.34,63.5 3.81,63.5 3.81,67.31 1.27,69.85 1.27,125.73
5V0_FILT  (via drill 0.61)
  Top 0.533: U5A.2 18.36,89.94 18.36,88.67 | 18.36,88.67 U5A.3 | 18.36,88.67 18.36,89.84 18.49,89.97 v20.27,89.97 | U5B.5 21.34,82.81 v21.34,81.25
  Bottom 0.533: v20.27,89.97 21.34,88.9 v21.34,81.25 21.34,75.21 v26.49,70.05
  pour Top (isolate 0.254): 41.91,1.27 41.91,73.03 36.83,73.03 33.66,76.2 29.84,76.2 23.18,69.53 23.18,58.42 22.54,57.78 20.95,57.78 20.32,58.42 15.88,58.42 13.34,55.88 3.81,55.88 3.81,52.07 1.27,49.53 1.27,1.27
COMP_SYNC  (via drill 0.41)
  Top 0.178: v7.82,36.63 7.82,37.69 6.4,39.12 3.2,39.12 2.67,39.65 2.67,50.85 4.09,52.27 4.09,69.88 v3.56,70.41 | U3B.1 15.65,36.8 v14.94,36.09 14.94,35.38 15.47,34.85 19.91,34.85 20.62,35.56 20.62,37.34 21.16,37.87 21.16,38.41 21.49,38.73 U3A.1 | U1.43 19.07,111.26 17.6,112.72 5.87,112.72 4.27,111.12 4.27,105.08 3.38,104.19 3.38,99.57 4.09,98.86 4.09,97.97 v3.73,97.61
  Bottom 0.178: v7.82,36.63 14.4,36.63 v14.94,36.09 | v3.56,70.41 2.49,70.41 2.13,70.76 2.13,71.83 3.38,73.08 3.38,94.77 2.31,95.83 2.31,97.08 2.85,97.61 v3.73,97.61
EXM_PMA2_CN11_SS2_RG9
  Top 0.178: EXP.19 9.02,77.47 9.07,77.7 11.2,79.83 11.2,82.68 12.45,83.92 12.45,86.94 13.87,88.37 13.87,91.21 15.65,92.99 18.14,92.99 20.07,94.92 U1.8
EXM_PMA3_CN10_SDO2_RG8
  Top 0.178: EXP.20 7.64,78.77 9.6,78.77 10.85,80.01 10.85,82.86 12.09,84.1 12.09,87.12 13.51,88.54 13.51,91.39 15.47,93.34 17.78,93.34 19.07,94.64 U1.6
EXM_PMA4_CN9_SDI2_RG7
  Top 0.178: EXP.21 10.49,81.61 10.49,83.03 11.73,84.28 11.73,87.3 13.16,88.72 13.16,91.57 15.29,93.7 17.6,93.7 18.57,94.67 U1.5
EXM_PMA5_CN8_SCK2_RG6
  Top 0.178: EXP.22 6.4,80.01 7.64,81.25 9.6,81.25 10.13,81.79 10.13,83.21 11.38,84.45 11.38,87.48 12.8,88.9 12.8,91.75 15.11,94.06 17.42,94.06 18.07,94.7 U1.4
EXM_PMA8_SCL2_CN18_U2TX_RF5  (via drill 0.41)
  Top 0.178: U1.32 27.29,105.35 32.54,100.1 32.54,82.32 20.98,70.76 16,70.76 15.82,70.59 15.82,70.05 15.47,69.7 15.47,68.1 15.11,67.74 v13.87,67.74 | EXP.8 6.35,62.36 7.29,63.3 v11.02,63.3
  Bottom 0.178: v13.87,67.74 13.51,68.1 12.27,68.1 12.09,67.92 12.09,66.5 11.02,65.43 v11.02,63.3
EXM_PMA9_SDA2_CN17_U2RX_RF4  (via drill 0.41)
  Top 0.178: U1.31 27.25,104.85 32.18,99.92 32.18,82.5 20.8,71.12 15.82,71.12 15.47,70.76 15.47,70.23 14.76,69.52 v14.76,68.45
  Bottom 0.178: v14.76,68.45 12.09,68.45 11.73,68.1 11.73,66.67 10.49,65.43 10.49,63.83 EXP.7
EXM_RB0_AN0_CN2_PMA6  (via drill 0.41)
  Top 0.178: U1.16 24.07,95.3 v25.6,95.3
  Bottom 0.178: 33.71,96.52 33.73,96.55 | 33.71,96.52 LED1.K1 | v25.6,95.3 26.49,96.19 28.27,96.19 29.52,97.43 32.84,97.43 33.71,96.52
EXM_RB10_AN10_TMS_CVREF_PMA13  (via drill 0.41)
  Top 0.178: U1.23 27.95,100.85 30.05,98.75 30.05,83.57 19.74,73.25 14.58,73.25 v14.22,73.61
  Bottom 0.178: v14.22,73.61 12.98,73.61 11.73,72.36 9.07,72.36 9.04,72.39 EXP.15
EXM_RB11_AN11_TDO_PMA12  (via drill 0.41)
  Top 0.178: U1.24 27.99,101.35 30.4,98.93 30.4,83.39 19.91,72.9 v13.51,72.9
  Bottom 0.178: EXP.16 6.38,72.39 7.47,71.3 11.2,71.3 12.8,72.9 v13.51,72.9
EXM_RB12_AN12_TCK_PMA11  (via drill 0.41)
  Top 0.178: U1.27 27.12,102.85 30.76,99.21 30.76,83.21 20.09,72.54 14.58,72.54 v14.22,72.19
  Bottom 0.178: EXP.13 8.89,69.88 10.31,69.88 12.62,72.19 v14.22,72.19
EXM_RB13_AN13_TDI_PMA10  (via drill 0.41)
  Top 0.178: U1.28 27.16,103.35 31.11,99.39 31.11,83.03 20.27,72.19 15.29,72.19 14.58,71.48 v13.51,71.48
  Bottom 0.178: v13.51,71.48 12.45,71.48 9.6,68.63 7.47,68.63 6.25,69.85 | 6.25,69.85 6.22,69.88 | EXP.14 6.25,69.85
EXM_RB14_AN14_U2RTS_BCLK2_PMA1  (via drill 0.41)
  Top 0.178: U1.29 27.19,103.85 31.47,99.57 31.47,82.86 20.45,71.83 15.47,71.83 v14.4,70.76
  Bottom 0.178: v14.4,70.76 12.27,70.76 8.89,67.39 EXP.11
EXM_RB15_AN15_CN12_OCFB_PMA0  (via drill 0.41)
  Top 0.178: U1.30 27.22,104.35 31.83,99.75 31.83,82.68 20.62,71.48 15.65,71.48 15.11,70.94 15.11,70.41 14.76,70.05 v13.51,70.05
  Bottom 0.178: v13.51,70.05 12.09,70.05 10.67,68.63 10.67,67.21 9.6,66.14 7.64,66.14 6.48,67.31 EXP.12
EXM_RC15_CLKO
  Top 0.178: U1.40 20.57,106.27 20.09,105.79 6.93,105.79 6.4,105.26 6.4,102.95 6.35,102.89 EXP.40
EXM_RD2_OC3_U1RX
  Top 0.178: EXP.33 8.89,95.3 7.47,96.72 7.47,103.66 8.66,104.85 U1.50
  Bottom 0.178: EXP.33 8.94,95.25 9.96,94.23 9.96,73.61 10.49,73.08 11.91,73.08 13.16,74.32 14.58,74.32 15.11,73.79 15.11,70.41 14.05,69.34 11.91,69.34 11.02,68.45 11.02,67.03 8.89,64.9 EXP.9
EXM_RD3_OC4_U1TX
  Top 0.178: EXP.35 7.82,98.86 7.82,103.48 8.69,104.35 U1.51
  Bottom 0.178: EXP.35 10.31,96.37 10.31,73.79 10.67,73.43 11.73,73.43 12.98,74.68 14.76,74.68 15.47,73.97 15.47,70.23 14.22,68.99 12.09,68.99 11.38,68.28 11.38,66.85 10.13,65.61 10.13,64.01 9.6,63.48 7.64,63.48 EXP.10
EXM_RD4_OC5_IC5_CN13_PMWR
  Top 0.178: EXP.39 8.99,102.87 9.97,103.85 U1.52
EXM_RD5_PMRD_CN14
  Top 0.178: EXP.37 8.89,100.28 9.96,101.35 9.96,102.77 10.54,103.35 U1.53
EXM_RD6_CN15
  Top 0.178: EXP.32 6.35,92.76 7.64,94.06 9.6,94.06 10.31,94.77 10.31,102.59 10.67,102.95 13.34,102.95 13.43,102.85 U1.54
EXM_RD7_CN16
  Top 0.178: EXP.31 8.89,92.63 10.67,94.41 10.67,102.41 10.85,102.59 13.16,102.59 13.4,102.35 U1.55
EXM_RD11_IC4_INT4_PMCS1
  Top 0.178: EXP.38 6.27,100.33 6.22,100.46 5.16,101.52 5.16,103.3 6.04,104.19 6.04,105.44 6.76,106.15 17.78,106.15 18.07,106.44 U1.45
EXM_SOSCI_CN1_RC13
  Top 0.178: EXP.34 6.27,95.25 6.22,95.48 5.16,96.37 5.16,99.39 4.45,100.1 4.45,103.66 5.33,104.55 5.33,110.59 6.4,111.66 17.07,111.66 17.78,110.95 17.78,109.17 17.07,108.46 U1.47
EXM_SOSCO_T1CK_CN0_RC14
  Top 0.178: U1.48 16.57,106.86 16,106.86 15.65,106.5 6.58,106.5 5.69,105.61 5.69,104.37 4.8,103.48 4.8,100.28 6.4,98.68 6.4,97.79 EXP.36
EXP_MOUSE_D0
  Top 0.178: U1.60 13.54,99.85 11.02,97.33 11.02,94.23 9.96,93.17 9.96,91.92 9.42,91.39 7.64,91.39 6.4,90.14 6.38,90.17 EXP.30
EXP_MOUSE_D1
  Top 0.178: U1.61 13.57,99.35 11.38,97.16 11.38,94.06 10.31,92.99 10.31,91.75 9.07,90.5 EXP.29
EXP_MOUSE_D2
  Top 0.178: U1.62 13.61,98.85 11.73,96.98 11.73,93.88 10.67,92.81 10.67,89.97 9.6,88.9 7.64,88.9 6.38,87.63 EXP.28
EXP_MOUSE_D3
  Top 0.178: U1.63 13.64,98.35 12.09,96.8 12.09,93.7 11.02,92.63 11.02,89.79 8.89,87.66 EXP.27
EXP_MOUSE_D4
  Top 0.178: EXP.26 6.35,85.11 7.64,86.41 9.6,86.41 9.96,86.77 9.96,88.19 11.38,89.61 11.38,92.46 12.45,93.52 12.45,96.62 13.69,97.87 14.52,97.87 U1.64
EXP_MOUSE_D5
  Top 0.178: EXP.25 8.89,85.17 10.31,86.59 10.31,88.01 11.73,89.43 11.73,92.28 14.76,95.3 16.54,95.3 U1.1
EXP_MOUSE_D6
  Top 0.178: EXP.24 6.4,82.5 7.64,83.74 9.6,83.74 10.67,84.81 10.67,87.83 12.09,89.26 12.09,92.1 14.76,94.77 16.89,94.77 17.07,94.94 U1.2
EXP_MOUSE_D7
  Top 0.178: EXP.23 9.02,82.55 9.25,82.86 11.02,84.63 11.02,87.66 12.45,89.08 12.45,91.92 14.94,94.41 17.25,94.41 17.57,94.73 U1.3
GND  (via drill 0.41, 0.61, 0.81, 1.36, 1.55)
  Top 0.229: U1.9 20.57,97.44 v21.03,97.87 | U1.41 20.07,108.59 v20.37,108.89
  Top 0.254: U1.25 23.8,101.85 v23.47,101.52 24.36,100.64 24.36,99.92 24.93,99.35 U1.20
  Top 0.305: R5.1 18.95,13.99 v18.95,15.65 18.95,17.12 R3.1 | 16.22,32.99 U3B.4 | 16.22,32.99 16.19,33.02 13.68,33.02 13.36,33.34 13.34,38.41 13.66,38.73 U3A.4 | 15.24,27.3 C10.2 | 15.24,27.3 15.24,28.89 15.88,29.53 15.88,32.07 16.22,32.41 16.22,32.99 | R1.1 15.24,24.77 15.24,27.3
  Top 0.406: U2.7 5.84,41.91 v5.84,40.95 | C5.2 v13.34,19.51 | C6.2 v17.6,46.99 | C4.2 v15.24,84.91
  Top 0.533: U5B.2 v20.32,84.45 | C3.2 v23.04,111.12 | C1.2 v11.43,122.56 | U5A.1 20.02,91.21 20.27,91.47 v20.27,92 | C9.2 25.63,107.57 25.55,107.57 v25.55,106.68
  Top 0.61: C2.2 27,90.25 v27,89.1 | C21.2 11.81,99.47 v11.56,99.21 | C8.- 34.8,100.33 35.92,99.92 v35.92,98.68
  Top 0.813: X1.2 10.87,114.66 v12.83,114.66 | C22.- 7.47,109.22 7.47,108.1 7.11,107.75 v6.4,107.75
  Top 1.016: VR1.2 v21.41,59.69
  Top 1.27: EXP.5 VR1.4
  Top 1.422: C7.- 20.95,52.7 v20.95,49.53
  Top 1.778: J4.2 39.6,85.72 v39.6,88.42
  pour Bottom (isolate 0.254, rank 6): 1.27,125.73 41.91,125.73 41.91,1.27 1.27,1.27 1.27,49.53 3.81,52.07 3.81,67.31 1.27,69.85
LP_HIT_FROM_PEN  (via drill 0.41)
  Top 0.178: R5.2 20.55,13.87 20.55,12.09 | 20.47,12.09 R4.1 | 20.55,12.09 26.02,12.09 J1.1 26.05,12.09 | 20.55,12.09 20.55,9.42 20.02,8.89 8.53,8.89 v7.82,9.6 | v3.73,40.18 3.38,40.54 3.38,44.45 | 3.38,44.45 U2.5 | 3.38,44.45 3.38,50.49 4.8,51.92 4.8,70.76 v3.73,71.83 | U1.46 17.57,108.43 18.14,108.99 18.14,111.12 17.25,112.01 6.22,112.01 4.98,110.77 4.98,104.72 4.09,103.83 4.09,99.92 4.8,99.21 4.8,97.08 v3.73,96.01
  Top 0.305: 20.55,12.09 20.47,12.09
  Bottom 0.178: v7.82,9.6 3.56,9.6 3.02,10.13 3.02,39.47 v3.73,40.18 | v3.73,71.83 4.09,72.19 4.09,95.66 v3.73,96.01
LP_HIT_TO_CMI  (via drill 0.41)
  Top 0.178: v16.54,44.45 14.22,44.45 12.98,45.7 11.56,45.7 11.53,45.72 U2.11
  Bottom 0.178: v16.54,44.45 21.87,44.45 22.58,45.16 22.58,57.96 24.18,59.56 24.18,61.7 25.98,63.5 J2.1
LP_TOUCH_FROM_PEN  (via drill 0.41)
  Top 0.178: 20.47,19.02 20.55,19.02 20.55,17.25 R3.2 | J1.3 26.06,19.02 20.47,19.02 | 20.47,19.02 R2.1 20.42,19.02 20.42,16 21.13,15.29 26.44,15.29 27.86,13.87 27.86,9.96 26.44,8.53 v7.64,8.53 | U1.59 15.58,100.35 16,99.92 16,97.43 15.11,96.55 v13.69,96.55
  Bottom 0.178: v7.64,8.53 6.93,9.25 3.38,9.25 2.67,9.96 2.67,42.14 6.93,46.41 6.93,51.03 6.58,51.38 6.04,51.38 5.16,52.27 5.16,98.15 5.87,98.86 9.42,98.86 11.73,96.55 v13.69,96.55
LP_TOUCH_TO_CMI  (via drill 0.41)
  Top 0.178: U2.8 11.51,41.91 11.56,41.96 v16.54,41.96
  Bottom 0.178: v16.54,41.96 16.54,43.38 17.25,44.09 22.05,44.09 22.94,44.98 22.94,57.78 24.89,59.74 25.78,59.74 26.01,59.69 J2.3
MOUSE_D+
  Top 0.19: U1.37 22.1,107.4 22.1,108.97 22.67,109.54 27.14,109.54 J5.D+
MOUSE_D-
  Top 0.19: U1.36 22.57,108.87 22.86,109.16 27.3,109.16 28.26,110.11 29.65,110.11 J5.D-
MOUSE_VBUS  (via drill 0.41, 0.61)
  Top 0.178: 24.05,88.72 24.08,88.72 24.18,88.62 24.89,88.62 25.07,88.44 25.07,85.95 24.71,85.6 R16.1 24.13,85.47
  Top 0.533: 24.05,89.08 24.05,88.72 U5A.6 22.17,88.67 21.27,87.77 U5B.1 | 23.5,89.94 U5A.7 24.05,89.94 | 24.05,91.21 U5A.8 | U5A.8 23.5,91.21 | U5A.8 24.13,91.21 24.05,91.49 | J5.VBUS 29.67,107.57 | C9.1 27.15,107.57 29.64,107.57
  Top 0.61: J5.VBUS 29.67,107.59 29.64,107.57 29.67,107.57 v38.05,107.57 | 24.05,91.49 24.05,92.58 v23.65,92.99 | C8.+ 39.97,100.5 40.01,100.46 v40.01,102.41
  Top 0.813: 24.05,89.08 24.05,89.94 24.05,91.21
  Bottom 0.61: v23.65,92.99 23.65,95.48 28.25,99.9 28.25,106.12 29.69,107.57 29.67,107.59 J5.VBUS | v38.05,107.57 40.01,105.61 v40.01,102.41
MOUSE_VBUS_EN
  Top 0.178: U5B.4 18.88,82.83 18.49,83.21 18.49,87.3 18.39,87.4 U5A.4 18.21,87.4 18.14,87.48 18.06,87.4 17.68,87.4 17.6,87.48 19.74,87.48 20.09,87.83 20.09,88.44 21.34,89.69 21.34,92.35 21.57,92.59 U1.11
MOUSE_VBUS_OC
  Top 0.178: U5A.5 23.53,87.38 22.76,87.38 22.76,85.24 21.69,84.18 21.16,84.18 20.62,83.64 19.91,83.64 19.37,84.19 U5B.3 19.37,85.77 19.45,85.77 19.56,85.88 19.56,86.77 20.45,87.66 20.45,88.27 21.69,89.51 21.69,92.18 22.07,92.56 U1.12
N$1  (via drill 0.81)
  Top 0.254: C21.1 11.84,101.96 11.94,101.85 U1.56 15.79,101.85 16,102.06
  Top 0.406: 16,102.06 16.36,102.41
  Top 0.813: C22.+ 14.63,109.88 v16.89,109.88 | v16.89,104.72 16.36,104.01 16.36,102.41
  Bottom 0.813: v16.89,104.72 v16.89,109.88
N$2
  Top 0.305: 33.66,91.44 R6.1 LED1.A1
N$3
  Top 1.422: D1.A 39.37,76.2 39.37,78.11 J4.3
N$4
  Top 0.533: C11.2 20.95,41.91 arc90 19.68,40.64 U3A.2 19.68,36.2 arc-90 19.02,35.53 U3B.2
N$5  (via drill 0.41)
  Top 0.178: U1.15 23.57,94.84 23.65,94.77 25.07,94.77 25.43,94.41 v26.31,94.41
  Bottom 0.178: v26.31,94.41 26.31,95.48 26.67,95.83 28.45,95.83 29.69,97.08 31.77,97.08 33.38,95.48 35.15,95.48 36.22,96.55 36.17,96.55 LED1.K2
N$6
  Top 0.178: R1.2 16.69,24.85 | 16.69,24.85 16.71,24.71 | 16.61,24.89 16.64,24.89 16.69,24.85 | 16.61,27.28 C10.1 16.61,27.33
  Top 0.305: 16.61,24.89 16.61,27.28 | 16.61,27.33 16.61,28.63 17.14,29.16 U3A.6 18.1,31.11 18.41,31.43 18.41,32.07 20.64,34.29 21.91,34.29 21.93,34.27 U3B.6
N$16
  Top 0.178: U1.39 21.07,109.79 12.27,118.59 10.81,118.59 X1.3
N$25  (via drill 0.41)
  Top 0.178: U1.18 27.53,98.35 v28.45,97.43
  Bottom 0.178: v28.45,97.43 28.45,97.97 29.87,99.39 29.87,105.44 32.36,107.92 32.36,114.68 29.52,117.53 23.09,117.53 ICP.4A
N$26  (via drill 0.41)
  Top 0.178: U1.17 27.14,97.85 27.56,97.43 v27.56,96.9
  Bottom 0.178: v27.56,96.9 27.56,97.61 29.52,99.57 29.52,105.61 32,108.1 32,114.5 29.34,117.17 23.98,117.17 23.01,116.2 ICP.5A
N$27  (via drill 0.41)
  Top 0.178: 11.38,44.45 U2.10 11.3,44.42 11.3,43.2 U2.9 11.23,43.18 11.2,43.2 v13.34,43.2 | U1.58 14.48,100.81 v12.98,100.81 | v8.53,50.67 v6.22,50.67
  Bottom 0.178: v6.22,50.67 4.8,52.09 4.8,98.32 5.69,99.21 9.42,99.21 11.02,100.81 v12.98,100.81 | v8.53,50.67 12.62,50.67 13.34,49.96 v13.34,43.2
N$29  (via drill 0.41)
  Top 0.178: U2.13 11.38,48.21 12.52,48.21 12.7,48.03 12.7,47.14 12.52,46.97 11.35,46.97 U2.12 11.3,46.97 11.28,46.99 v9.58,46.99 | 5.23,43.23 U2.6 5.26,43.26 v7.26,43.26
  Bottom 0.178: v9.58,46.99 9.58,45.57 v7.26,43.26
N$30
  Top 0.178: 5.08,45.7 5.08,45.72 | 5.08,45.72 U2.4 | U2.3 5.08,46.99 5.08,45.72
N$31  (via drill 0.41)
  Top 0.178: 5.08,48.26 5.08,48.18 | 5.08,48.26 U2.2 | 5.08,49.53 U2.1 | 5.08,49.53 5.08,48.26 | 14.58,105.33 14.58,105.35 U1.49 14.5,105.33 7.54,105.33 v7.11,104.9 | 5.08,49.53 5.05,49.53 5.16,49.61 v5.16,50.49
  Bottom 0.178: v7.11,104.9 5.69,104.9 5.16,104.37 5.16,99.21 4.45,98.5 4.45,51.21 v5.16,50.49
N$34
  Top 0.305: 36.2,91.44 R7.1 LED1.A2
N$36  (via drill 0.41)
  Top 0.178: R16.2 24.16,84.07 24.18,84.1 v23.11,84.1 | U1.34 23.57,105.71 v23.11,105.26
  Bottom 0.178: v23.11,84.1 23.11,90.68 21.87,91.92 21.87,104.01 v23.11,105.26
U2_MCLR  (via drill 0.41)
  Top 0.178: U1.7 19.57,98.51 v19.2,98.86 | 20.78,113.08 R12.1 20.3,113.06 20.27,113.08 v20.27,114.5 19.74,114.5 19.2,115.04 19.2,115.93 19.02,116.1 19.05,116.13 ICP.1A
  Bottom 0.178: v19.2,98.86 19.2,103.3 21.69,105.79 21.69,113.08 v20.27,114.5
VIDEO
  Top 0.533: J2.5 26.16,55.75 C11.1 26.16,40.51 arc90 27.3,39.37 29.84,39.37 arc-90 J3.PIN
  Top 0.61: J1.5 28.14,26.03 arc90 30.02,27.91 30.02,39.12 arc90 J3.PIN
VIDEO_GND
  pour Bottom (isolate 0.508, rank 4): 12.7,34.29 12.7,27.3 arc-90 11.43,26.04 10.16,26.04 arc90 8.89,24.77 8.89,22.86 arc90 10.16,21.59 31.75,21.59 arc90 33.02,22.86 33.02,30.48 arc-90 34.29,31.75 35.56,31.75 arc90 36.83,33.02 36.83,45.72 arc90 35.56,46.99 33.66,46.99 arc-90 31.75,48.9 31.75,56.52 arc90 30.48,57.78 25.4,57.78 arc90 24.13,56.52 24.13,44.45 arc-90 22.23,42.55 19.68,42.55 arc90 18.41,41.27 18.41,38.1 arc-90 15.88,35.56 13.97,35.56 arc90
VSYNC  (via drill 0.41)
  Top 0.178: U3A.3 17.14,38.76 | U1.44 18.59,107.42 18.59,111.2 17.42,112.37 6.04,112.37 4.62,110.95 4.62,104.9 3.73,104.01 3.73,99.75 4.45,99.03 4.45,97.26 3.91,96.72 v3.02,96.72 | 17.25,38.76 17.17,38.76 U3A.3 | U3A.3 16.15,38.73 15.82,38.41 15.82,37.87 14.94,36.98 14.4,36.98 13.87,36.45 13.87,35.2 14.76,34.31 16.71,34.31 16.76,34.27 U3B.3 | v8.53,37.52 6.58,39.47 3.38,39.47 3.02,39.83 3.02,50.67 4.45,52.09 4.45,70.59 3.91,71.12 v2.85,71.12
  Bottom 0.178: v8.53,37.52 9.07,36.98 16.71,36.98 17.07,37.34 17.07,38.58 17.14,38.66 U3A.3 | v2.85,71.12 2.85,72.01 3.73,72.9 3.73,94.94 3.02,95.66 v3.02,96.72

### Text on the board
tPlace: REV2 | FROM CMI | TO VDU | CMI Lightpen | USB Mouse Adapter | Copyright 2010 | Joe Britt | S/N